# EAGLE design Modular_RFPA_v103_DFM_03_26_22 (EAGLE 6.6.0)

## Sheet 1 of 4
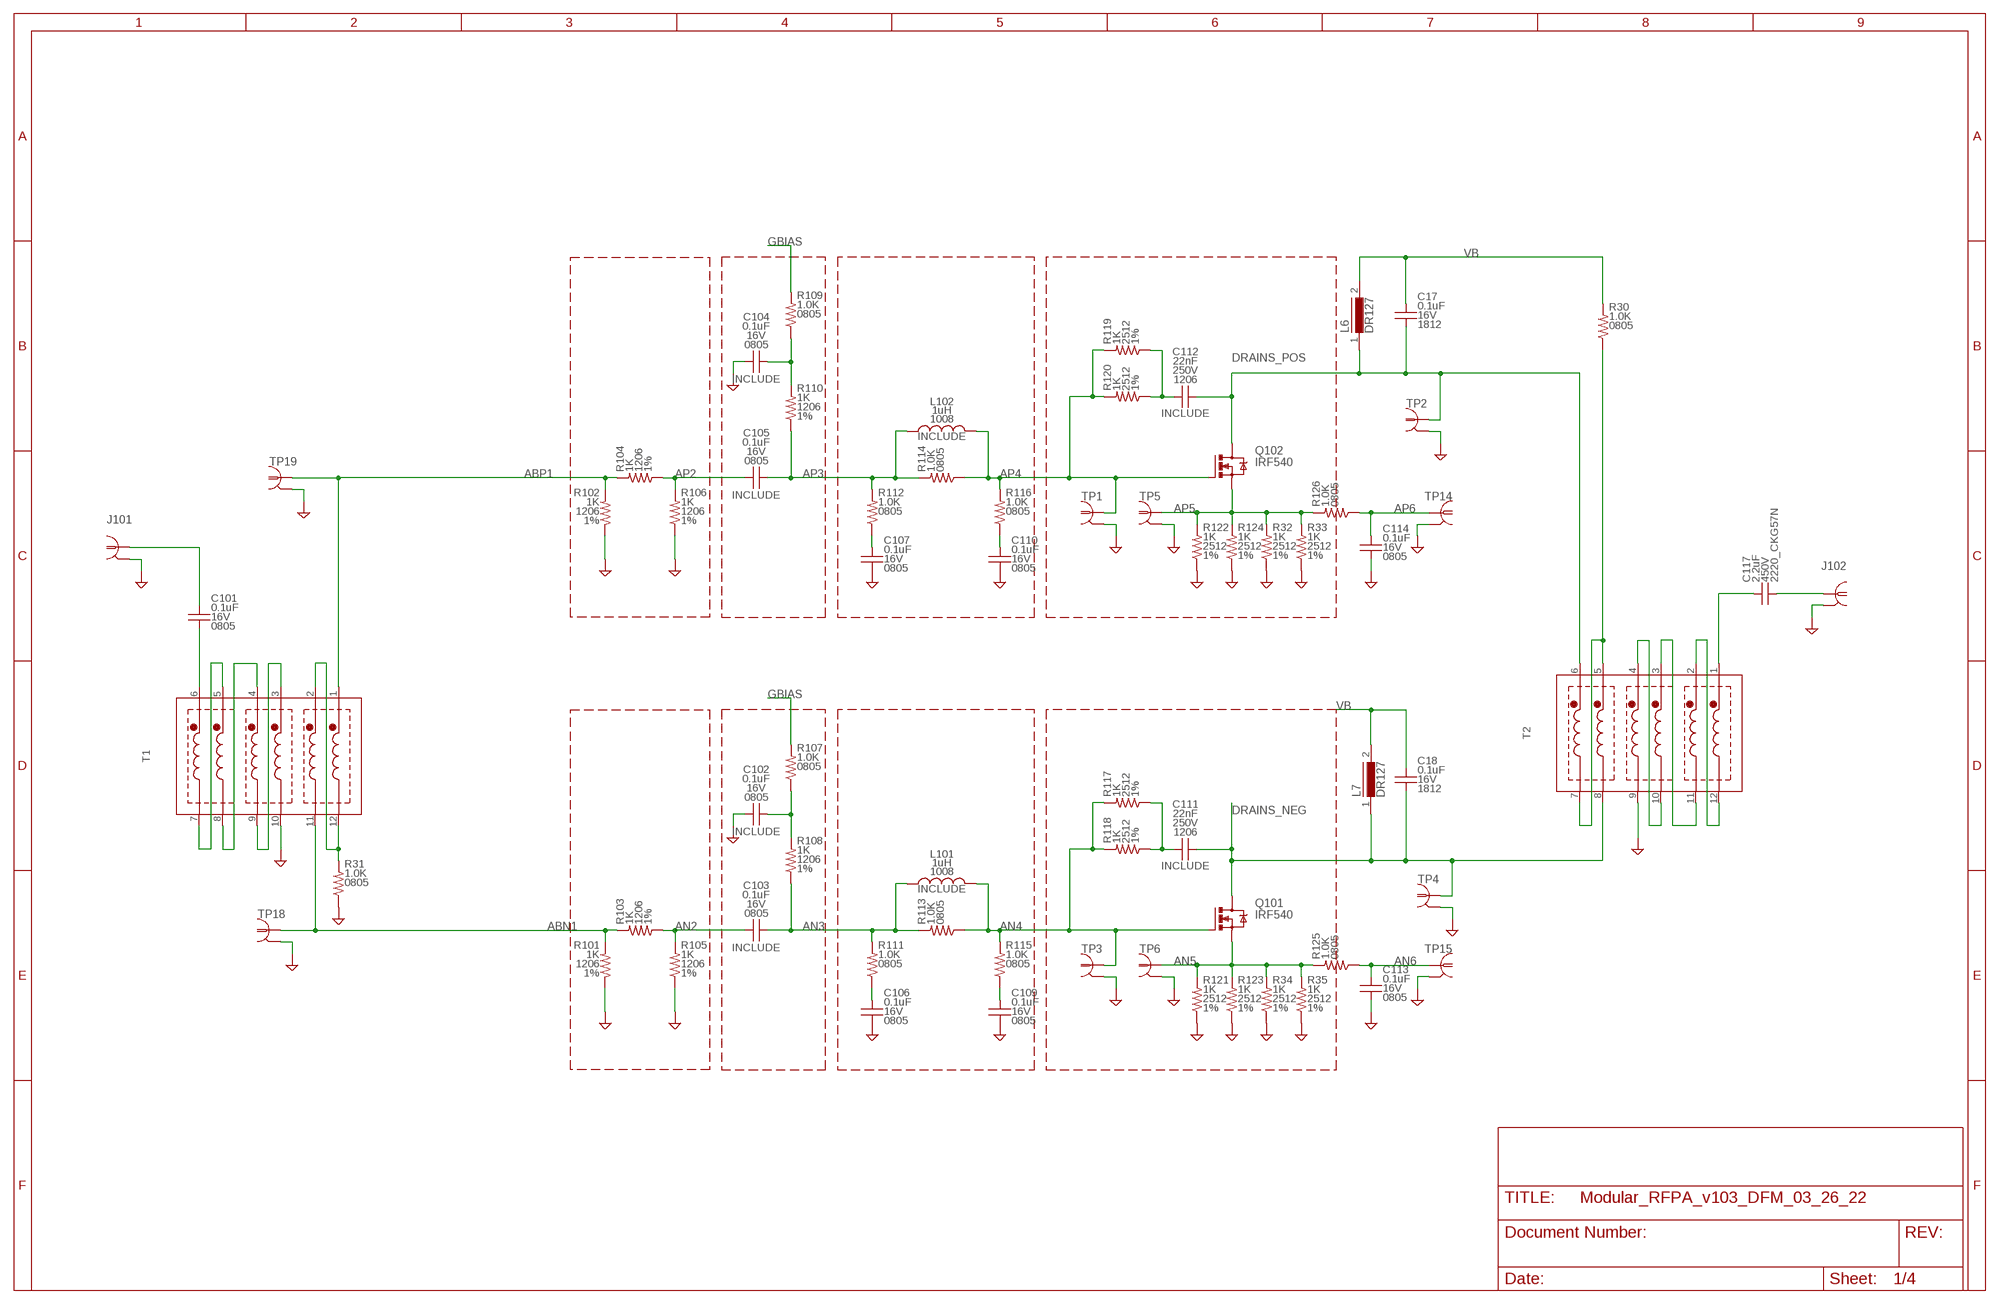
[diagram p0: schematic, sheet 1]

### Parts
C17  0.1uF  CC1812  [C1812]
C18  0.1uF  CC1812  [C1812]
C101  0.1uF  CC-0.1U-16V-0805-X7R0805_IPC  [0805_IPC-7351B]
C102  0.1uF  CC-0.1U-16V-0805-X7R0805_IPC  [0805_IPC-7351B]
C103  0.1uF  CC-0.1U-16V-0805-X7R0805_IPC  [0805_IPC-7351B]
C104  0.1uF  CC-0.1U-16V-0805-X7R0805_IPC  [0805_IPC-7351B]
C105  0.1uF  CC-0.1U-16V-0805-X7R0805_IPC  [0805_IPC-7351B]
C106  0.1uF  CC-0.1U-16V-0805-X7R0805_IPC  [0805_IPC-7351B]
C107  0.1uF  CC-0.1U-16V-0805-X7R0805_IPC  [0805_IPC-7351B]
C109  0.1uF  CC-0.1U-16V-0805-X7R0805_IPC  [0805_IPC-7351B]
C110  0.1uF  CC-0.1U-16V-0805-X7R0805_IPC  [0805_IPC-7351B]
C111  22nF  CC-22N-250V-5%-1206-NP0C1206  [C1206]
C112  22nF  CC-22N-250V-5%-1206-NP0C1206  [C1206]
C113  0.1uF  CC-0.1U-16V-0805-X7R0805_IPC  [0805_IPC-7351B]
C114  0.1uF  CC-0.1U-16V-0805-X7R0805_IPC  [0805_IPC-7351B]
C117  2.2uF  CC-2.2U-450V-20%-2220-X7TC2220_CKG57N  [C2220_CKG57N]
J101  COAXBNC_EDGE  [BNC_EDGE]
J102  COAXBNC_EDGE  [BNC_EDGE]
L6  DR127  [DR127]
L7  DR127  [DR127]
L101  1uH  L_CHIPL-1.0U-AIR-5%-1008-0.37A1008  [L1008]
L102  1uH  L_CHIPL-1.0U-AIR-5%-1008-0.37A1008  [L1008]
Q101  IRF540  [TO220BV]
Q102  IRF540  [TO220BV]
R30  1.0K  RR-1.0K-0.1%-0805-0.1W0805_IPC  [0805_IPC-7351B]
R31  1.0K  RR-1.0K-0.1%-0805-0.1W0805_IPC  [0805_IPC-7351B]
R32  1K  RR-1K-1%-2512-1WR2512  [R2512]
R33  1K  RR-1K-1%-2512-1WR2512  [R2512]
R34  1K  RR-1K-1%-2512-1WR2512  [R2512]
R35  1K  RR-1K-1%-2512-1WR2512  [R2512]
R101  1K  RR-1.0K-1%-1206-0.25WR1206  [R1206]
R102  1K  RR-1.0K-1%-1206-0.25WR1206  [R1206]
R103  1K  RR-1.0K-1%-1206-0.25WR1206  [R1206]
R104  1K  RR-1.0K-1%-1206-0.25WR1206  [R1206]
R105  1K  RR-1.0K-1%-1206-0.25WR1206  [R1206]
R106  1K  RR-1.0K-1%-1206-0.25WR1206  [R1206]
R107  1.0K  RR-1.0K-0.1%-0805-0.1W0805_IPC  [0805_IPC-7351B]
R108  1K  RR-1.0K-1%-1206-0.25WR1206  [R1206]
R109  1.0K  RR-1.0K-0.1%-0805-0.1W0805_IPC  [0805_IPC-7351B]
R110  1K  RR-1.0K-1%-1206-0.25WR1206  [R1206]
R111  1.0K  RR-1.0K-0.1%-0805-0.1W0805_IPC  [0805_IPC-7351B]
R112  1.0K  RR-1.0K-0.1%-0805-0.1W0805_IPC  [0805_IPC-7351B]
R113  1.0K  RR-1.0K-0.1%-0805-0.1W0805_IPC  [0805_IPC-7351B]
R114  1.0K  RR-1.0K-0.1%-0805-0.1W0805_IPC  [0805_IPC-7351B]
R115  1.0K  RR-1.0K-0.1%-0805-0.1W0805_IPC  [0805_IPC-7351B]
R116  1.0K  RR-1.0K-0.1%-0805-0.1W0805_IPC  [0805_IPC-7351B]
R117  1K  RR-1K-1%-2512-1WR2512  [R2512]
R118  1K  RR-1K-1%-2512-1WR2512  [R2512]
R119  1K  RR-1K-1%-2512-1WR2512  [R2512]
R120  1K  RR-1K-1%-2512-1WR2512  [R2512]
R121  1K  RR-1K-1%-2512-1WR2512  [R2512]
R122  1K  RR-1K-1%-2512-1WR2512  [R2512]
R123  1K  RR-1K-1%-2512-1WR2512  [R2512]
R124  1K  RR-1K-1%-2512-1WR2512  [R2512]
R125  1.0K  RR-1.0K-0.1%-0805-0.1W0805_IPC  [0805_IPC-7351B]
R126  1.0K  RR-1.0K-0.1%-0805-0.1W0805_IPC  [0805_IPC-7351B]
T1  HP4_TRAFO  [HP4]
T2  HP4_TRAFO  [HP4]
TP1  PROBE_TPTP_5MM  [PROBE_TP_5MM]
TP2  PROBE_TPTP_7P5MM  [PROBE_TP_7P5MM]
TP3  PROBE_TPTP_5MM  [PROBE_TP_5MM]
TP4  PROBE_TPTP_7P5MM  [PROBE_TP_7P5MM]
TP5  PROBE_TPTP_7P5MM  [PROBE_TP_7P5MM]
TP6  PROBE_TPTP_7P5MM  [PROBE_TP_7P5MM]
TP14  PROBE_TPTP_5MM  [PROBE_TP_5MM]
TP15  PROBE_TPTP_5MM  [PROBE_TP_5MM]
TP18  PROBE_TPTP_5MM  [PROBE_TP_5MM]
TP19  PROBE_TPTP_5MM  [PROBE_TP_5MM]

### Nets
ABN1: R101.1 R103.1 T1.11(F2) TP18.TP ; also sheet 2
ABP1: R102.1 R104.1 T1.1(S1) TP19.TP ; also sheet 2
AN2: C103.2 R103.2 R105.1
AN3: C103.1 L101.1 R108.2 R111.1 R113.1
AN4: L101.2 Q101.G R113.2 R115.1 R117.1 R118.1 TP3.TP
AN5: Q101.S R34.1 R35.1 R121.1 R123.1 R125.1 TP6.TP
AN6: C113.1 R125.2 TP15.TP
AP2: C105.2 R104.2 R106.1
AP3: C105.1 L102.1 R110.2 R112.1 R114.1
AP4: L102.2 Q102.G R114.2 R116.1 R119.1 R120.1 TP1.TP
AP5: Q102.S R32.1 R33.1 R122.1 R124.1 R126.1 TP5.TP
AP6: C114.1 R126.2 TP14.TP
DRAINS_NEG [32W_20S]: C18.2 C111.2 L7.1 Q101.D T2.8(F5) TP4.TP ; also sheet 2
DRAINS_POS [32W_30S]: C17.2 C112.2 L6.1 Q102.D T2.6(S6) TP2.TP ; also sheet 2
GBIAS: R107.1 R109.1 ; also sheet 2,3
GND: C102.2 C104.2 C106.2 C107.2 C109.2 C110.2 C113.2 C114.2 J101.G1(GND1) J101.G2(GND1) J101.G3(GND1) J101.G4(GND1) J102.G1(GND1) J102.G2(GND1) J102.G3(GND1) J102.G4(GND1) R31.2 R32.2 R33.2 R34.2 R35.2 R101.2 R102.2 R105.2 R106.2 R121.2 R122.2 R123.2 R124.2 T1.10(F3) T2.9(F4) TP1.GND(GND1) TP2.GND(GND1) TP3.GND(GND1) TP4.GND(GND1) TP5.GND(GND1) TP6.GND(GND1) TP14.GND(GND1) TP15.GND(GND1) TP18.GND(GND1) TP19.GND(GND1) ; also sheet 2,3,4
N$4: C111.1 R117.2 R118.2
N$5: C106.1 R111.2
N$8: C104.1 R109.2 R110.1
N$10: C107.1 R112.2
N$11: C110.1 R116.2
N$12: C112.1 R119.2 R120.2
N$13: C102.1 R107.2 R108.1
N$17: C109.1 R115.2
N$22: T1.3(S3) T1.9(F4)
N$27: R31.1 T1.2(S2) T1.12(F1)
N$29 [32W_30S]: T2.2(S2) T2.12(F1)
N$30 [32W_30S]: C117.1 T2.1(S1)
N$31 [32W_30S]: C117.2 J102.C
N$34: C101.1 J101.C
N$41: C101.2 T1.6(S6)
N$52 [32W_30S]: T2.3(S3) T2.11(F2)
N$57: T1.4(S4) T1.8(F5)
N$58 [32W_30S]: T2.4(S4) T2.10(F3)
VB [50W_30S]: C17.1 C18.1 L6.2 L7.2 R30.1 ; also sheet 4
VB_CT [32W_30S]: R30.2 T2.5(S5) T2.7(F6)
VB_CT1: T1.5(S5) T1.7(F6)

## Sheet 2 of 4
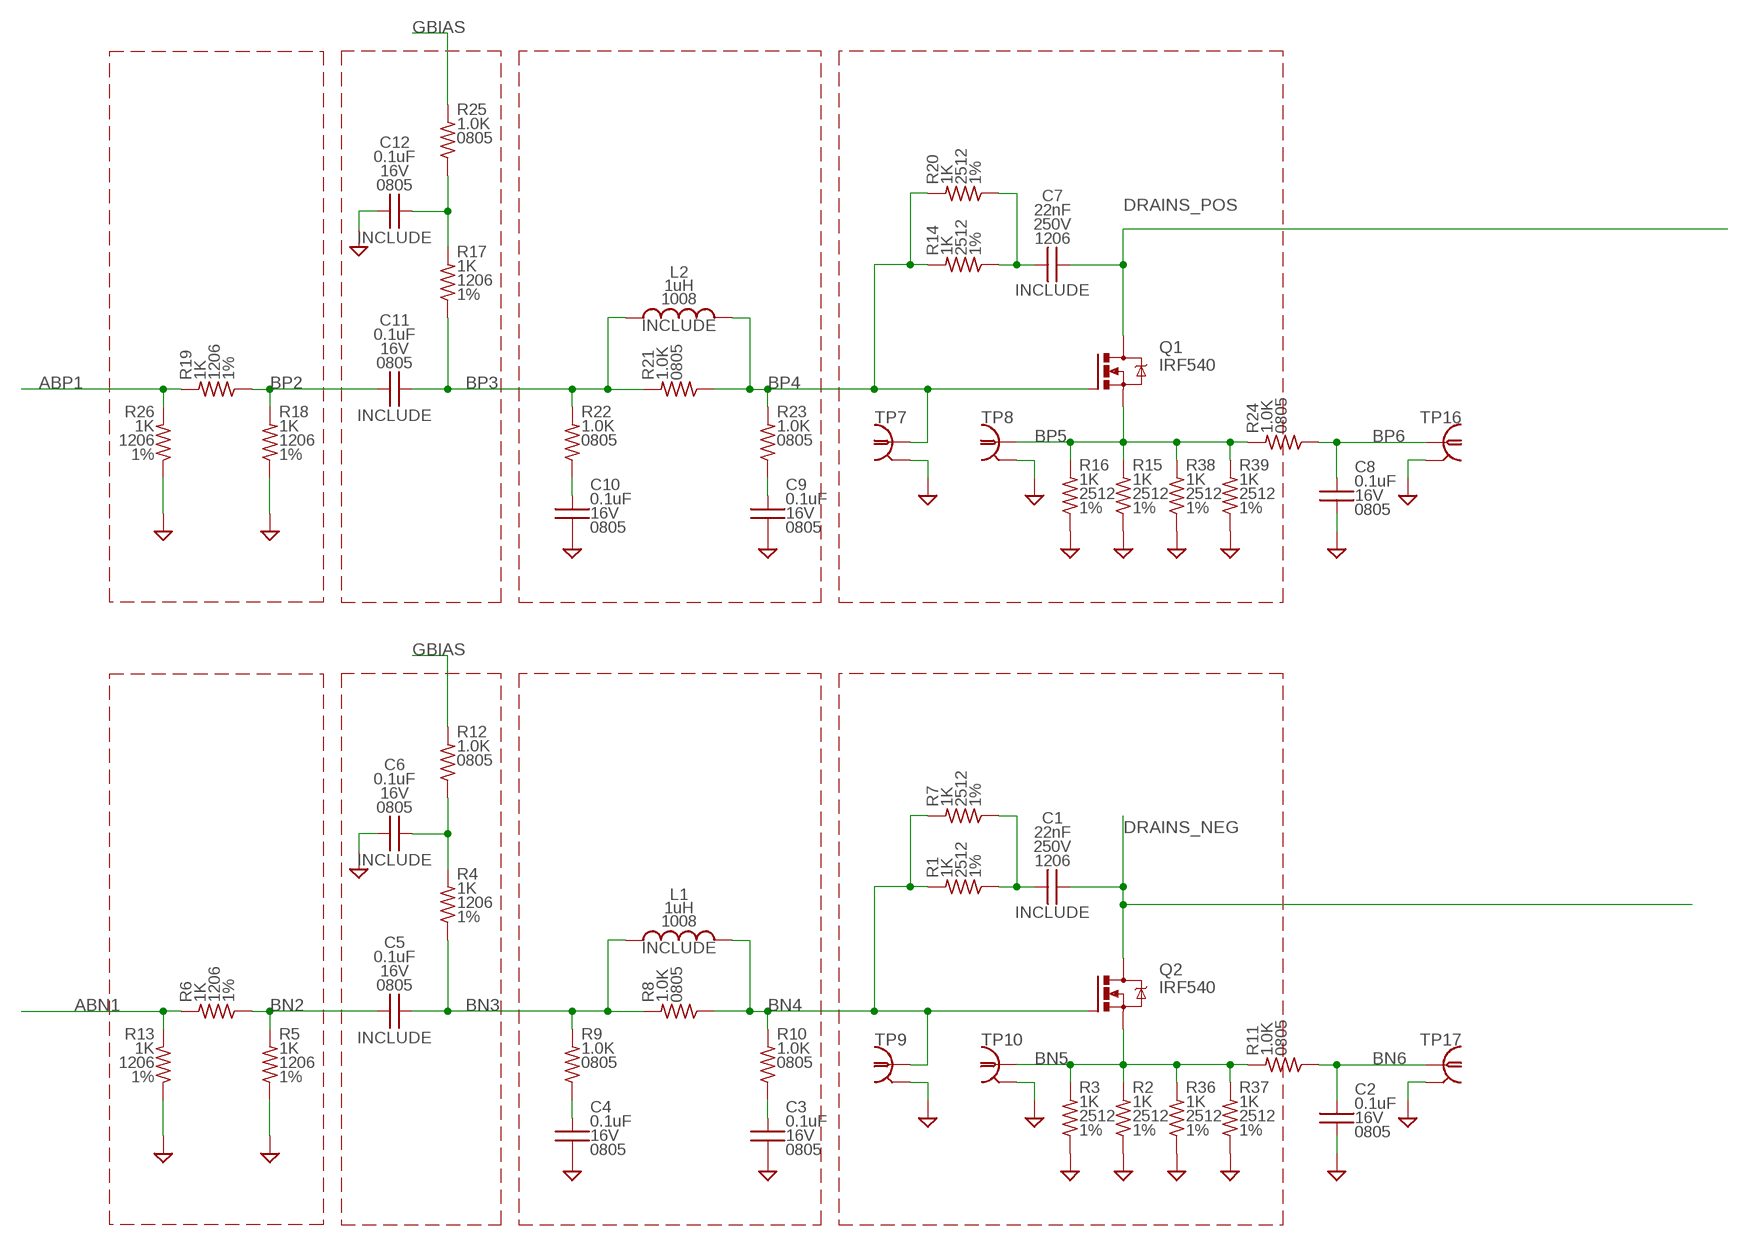
[diagram p1: schematic, sheet 2]

### Parts
C1  22nF  CC-22N-250V-5%-1206-NP0C1206  [C1206]
C2  0.1uF  CC-0.1U-16V-0805-X7R0805_IPC  [0805_IPC-7351B]
C3  0.1uF  CC-0.1U-16V-0805-X7R0805_IPC  [0805_IPC-7351B]
C4  0.1uF  CC-0.1U-16V-0805-X7R0805_IPC  [0805_IPC-7351B]
C5  0.1uF  CC-0.1U-16V-0805-X7R0805_IPC  [0805_IPC-7351B]
C6  0.1uF  CC-0.1U-16V-0805-X7R0805_IPC  [0805_IPC-7351B]
C7  22nF  CC-22N-250V-5%-1206-NP0C1206  [C1206]
C8  0.1uF  CC-0.1U-16V-0805-X7R0805_IPC  [0805_IPC-7351B]
C9  0.1uF  CC-0.1U-16V-0805-X7R0805_IPC  [0805_IPC-7351B]
C10  0.1uF  CC-0.1U-16V-0805-X7R0805_IPC  [0805_IPC-7351B]
C11  0.1uF  CC-0.1U-16V-0805-X7R0805_IPC  [0805_IPC-7351B]
C12  0.1uF  CC-0.1U-16V-0805-X7R0805_IPC  [0805_IPC-7351B]
L1  1uH  L_CHIPL-1.0U-AIR-5%-1008-0.37A1008  [L1008]
L2  1uH  L_CHIPL-1.0U-AIR-5%-1008-0.37A1008  [L1008]
Q1  IRF540  [TO220BV]
Q2  IRF540  [TO220BV]
R1  1K  RR-1K-1%-2512-1WR2512  [R2512]
R2  1K  RR-1K-1%-2512-1WR2512  [R2512]
R3  1K  RR-1K-1%-2512-1WR2512  [R2512]
R4  1K  RR-1.0K-1%-1206-0.25WR1206  [R1206]
R5  1K  RR-1.0K-1%-1206-0.25WR1206  [R1206]
R6  1K  RR-1.0K-1%-1206-0.25WR1206  [R1206]
R7  1K  RR-1K-1%-2512-1WR2512  [R2512]
R8  1.0K  RR-1.0K-0.1%-0805-0.1W0805_IPC  [0805_IPC-7351B]
R9  1.0K  RR-1.0K-0.1%-0805-0.1W0805_IPC  [0805_IPC-7351B]
R10  1.0K  RR-1.0K-0.1%-0805-0.1W0805_IPC  [0805_IPC-7351B]
R11  1.0K  RR-1.0K-0.1%-0805-0.1W0805_IPC  [0805_IPC-7351B]
R12  1.0K  RR-1.0K-0.1%-0805-0.1W0805_IPC  [0805_IPC-7351B]
R13  1K  RR-1.0K-1%-1206-0.25WR1206  [R1206]
R14  1K  RR-1K-1%-2512-1WR2512  [R2512]
R15  1K  RR-1K-1%-2512-1WR2512  [R2512]
R16  1K  RR-1K-1%-2512-1WR2512  [R2512]
R17  1K  RR-1.0K-1%-1206-0.25WR1206  [R1206]
R18  1K  RR-1.0K-1%-1206-0.25WR1206  [R1206]
R19  1K  RR-1.0K-1%-1206-0.25WR1206  [R1206]
R20  1K  RR-1K-1%-2512-1WR2512  [R2512]
R21  1.0K  RR-1.0K-0.1%-0805-0.1W0805_IPC  [0805_IPC-7351B]
R22  1.0K  RR-1.0K-0.1%-0805-0.1W0805_IPC  [0805_IPC-7351B]
R23  1.0K  RR-1.0K-0.1%-0805-0.1W0805_IPC  [0805_IPC-7351B]
R24  1.0K  RR-1.0K-0.1%-0805-0.1W0805_IPC  [0805_IPC-7351B]
R25  1.0K  RR-1.0K-0.1%-0805-0.1W0805_IPC  [0805_IPC-7351B]
R26  1K  RR-1.0K-1%-1206-0.25WR1206  [R1206]
R36  1K  RR-1K-1%-2512-1WR2512  [R2512]
R37  1K  RR-1K-1%-2512-1WR2512  [R2512]
R38  1K  RR-1K-1%-2512-1WR2512  [R2512]
R39  1K  RR-1K-1%-2512-1WR2512  [R2512]
TP7  PROBE_TPTP_5MM  [PROBE_TP_5MM]
TP8  PROBE_TPTP_7P5MM  [PROBE_TP_7P5MM]
TP9  PROBE_TPTP_5MM  [PROBE_TP_5MM]
TP10  PROBE_TPTP_5MM  [PROBE_TP_5MM]
TP16  PROBE_TPTP_5MM  [PROBE_TP_5MM]
TP17  PROBE_TPTP_7P5MM  [PROBE_TP_7P5MM]

### Nets
ABN1: R6.1 R13.1 ; also sheet 1
ABP1: R19.1 R26.1 ; also sheet 1
BN2: C5.2 R5.1 R6.2
BN3: C5.1 L1.1 R4.2 R8.1 R9.1
BN4: L1.2 Q2.G R1.1 R7.1 R8.2 R10.1 TP9.TP
BN5: Q2.S R2.1 R3.1 R11.1 R36.1 R37.1 TP10.TP
BN6: C2.1 R11.2 TP17.TP
BP2: C11.2 R18.1 R19.2
BP3: C11.1 L2.1 R17.2 R21.1 R22.1
BP4: L2.2 Q1.G R14.1 R20.1 R21.2 R23.1 TP7.TP
BP5: Q1.S R15.1 R16.1 R24.1 R38.1 R39.1 TP8.TP
BP6: C8.1 R24.2 TP16.TP
DRAINS_NEG [32W_20S]: C1.2 Q2.D ; also sheet 1
DRAINS_POS [32W_30S]: C7.2 Q1.D ; also sheet 1
GBIAS: R12.1 R25.1 ; also sheet 1,3
GND: C2.2 C3.2 C4.2 C6.2 C8.2 C9.2 C10.2 C12.2 R2.2 R3.2 R5.2 R13.2 R15.2 R16.2 R18.2 R26.2 R36.2 R37.2 R38.2 R39.2 TP7.GND(GND1) TP8.GND(GND1) TP9.GND(GND1) TP10.GND(GND1) TP16.GND(GND1) TP17.GND(GND1) ; also sheet 1,3,4
N$35: C6.1 R4.1 R12.2
N$36: C4.1 R9.2
N$38: C3.1 R10.2
N$39: C1.1 R1.2 R7.2
N$40: C12.1 R17.1 R25.2
N$42: C10.1 R22.2
N$48: C9.1 R23.2
N$50: C7.1 R14.2 R20.2

## Sheet 3 of 4
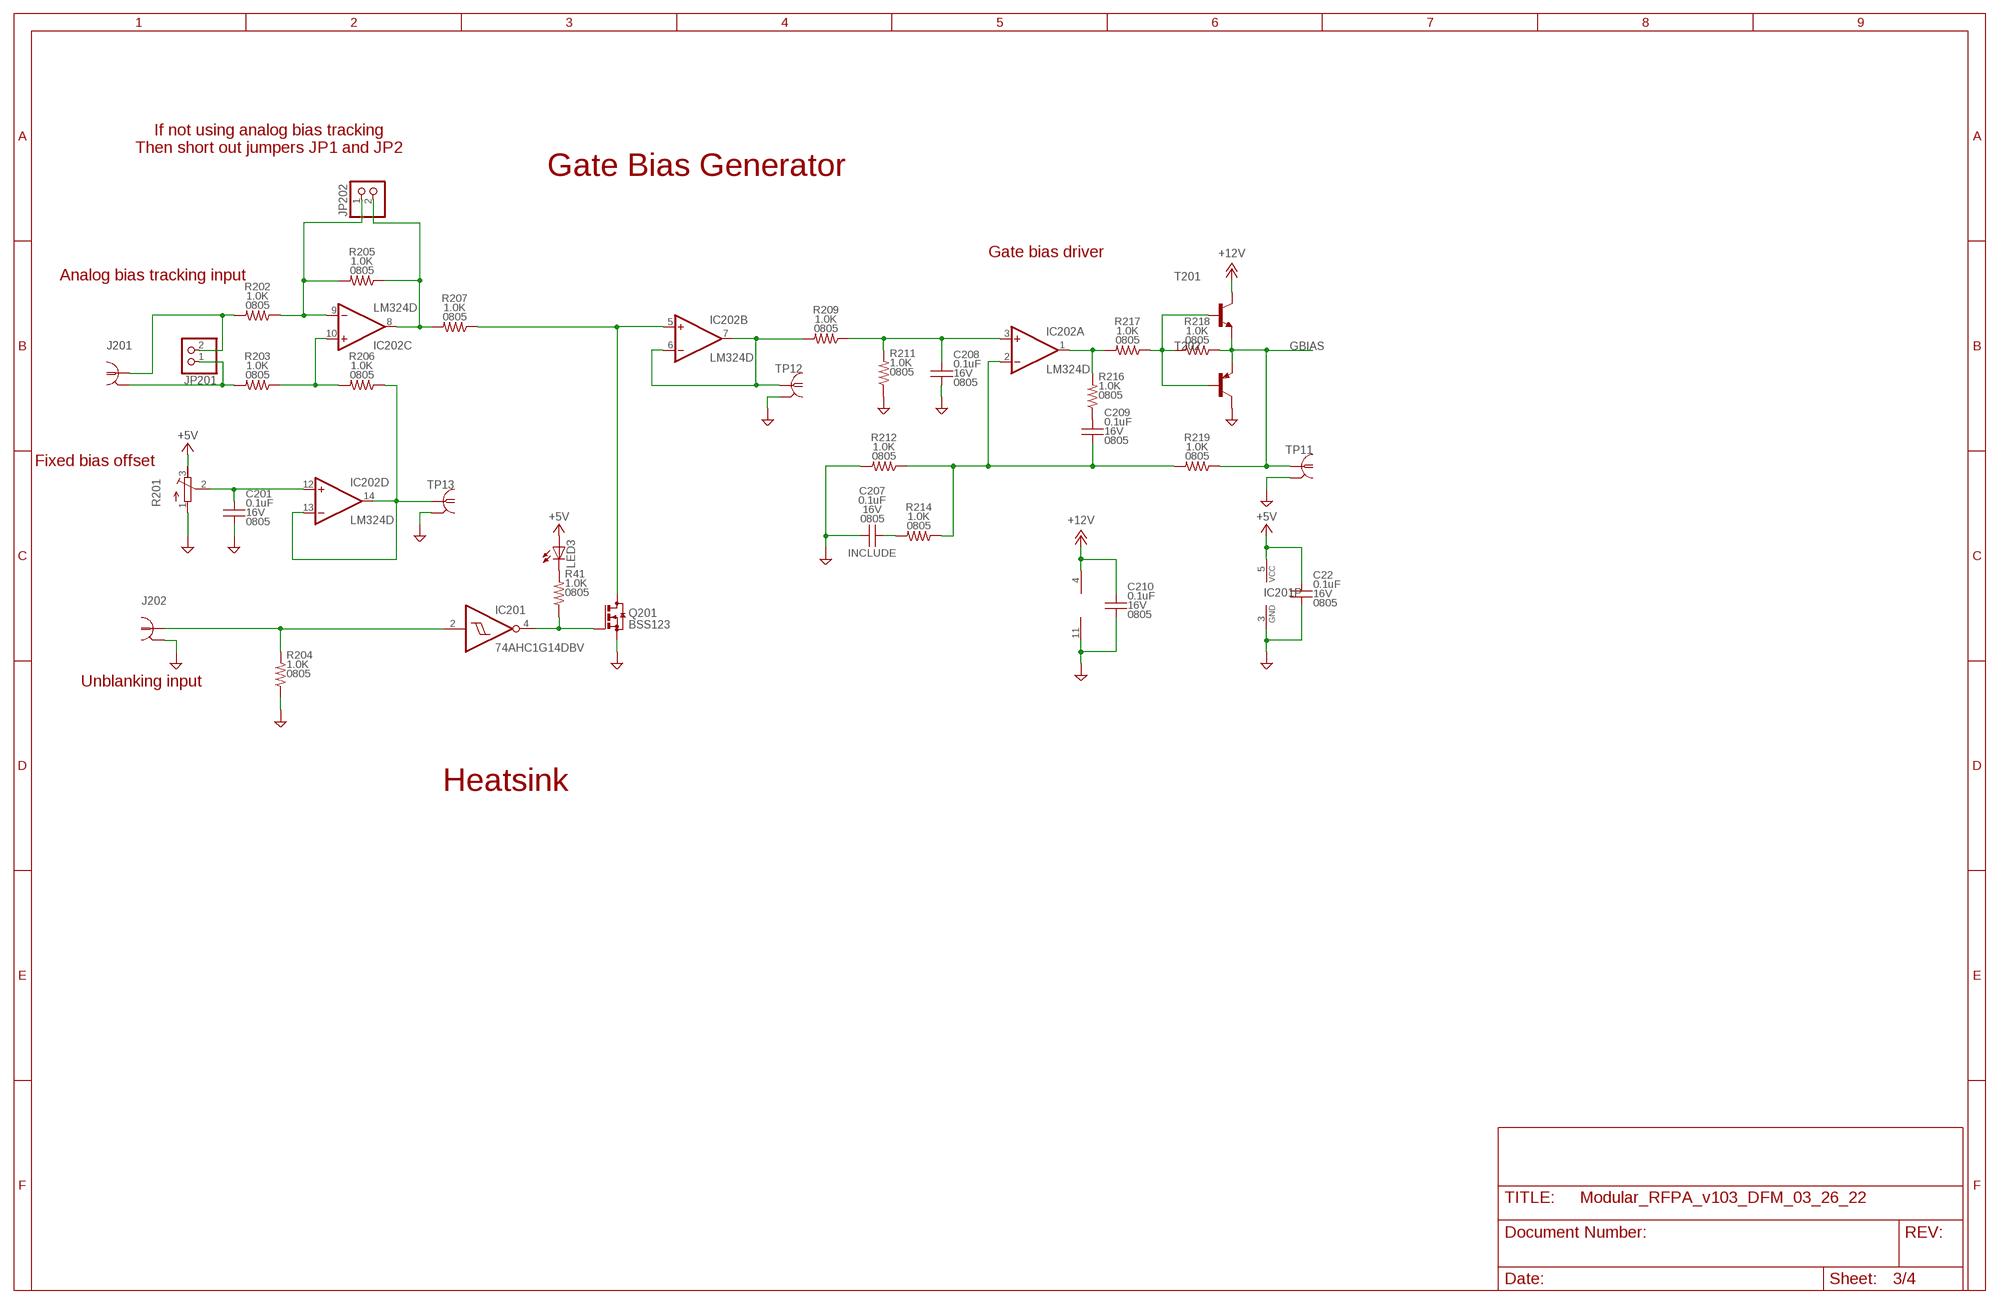
[diagram p2: schematic, sheet 3]

### Parts
C22  0.1uF  CC-0.1U-16V-0805-X7R0805_IPC  [0805_IPC-7351B]
C201  0.1uF  CC-0.1U-16V-0805-X7R0805_IPC  [0805_IPC-7351B]
C207  0.1uF  CC-0.1U-16V-0805-X7R0805_IPC  [0805_IPC-7351B]
C208  0.1uF  CC-0.1U-16V-0805-X7R0805_IPC  [0805_IPC-7351B]
C209  0.1uF  CC-0.1U-16V-0805-X7R0805_IPC  [0805_IPC-7351B]
C210  0.1uF  CC-0.1U-16V-0805-X7R0805_IPC  [0805_IPC-7351B]
IC201  74AHC1G14DBV  [SOT23-5]
IC202  LM324D  [SO14]
J201  COAXBNC_EDGE  [BNC_EDGE]
J202  COAXBNC_EDGE  [BNC_EDGE]
JP201  PINHD-1X2  [1X02]
JP202  PINHD-1X2  [1X02]
LED3  LED5MM  [LED5MM]
Q201  BSS123  [SOT23]
R41  1.0K  RR-1.0K-0.1%-0805-0.1W0805_IPC  [0805_IPC-7351B]
R201  R-TRIMM3299W  [RTRIM3299W]
R202  1.0K  RR-1.0K-0.1%-0805-0.1W0805_IPC  [0805_IPC-7351B]
R203  1.0K  RR-1.0K-0.1%-0805-0.1W0805_IPC  [0805_IPC-7351B]
R204  1.0K  RR-1.0K-0.1%-0805-0.1W0805_IPC  [0805_IPC-7351B]
R205  1.0K  RR-1.0K-0.1%-0805-0.1W0805_IPC  [0805_IPC-7351B]
R206  1.0K  RR-1.0K-0.1%-0805-0.1W0805_IPC  [0805_IPC-7351B]
R207  1.0K  RR-1.0K-0.1%-0805-0.1W0805_IPC  [0805_IPC-7351B]
R209  1.0K  RR-1.0K-0.1%-0805-0.1W0805_IPC  [0805_IPC-7351B]
R211  1.0K  RR-1.0K-0.1%-0805-0.1W0805_IPC  [0805_IPC-7351B]
R212  1.0K  RR-1.0K-0.1%-0805-0.1W0805_IPC  [0805_IPC-7351B]
R214  1.0K  RR-1.0K-0.1%-0805-0.1W0805_IPC  [0805_IPC-7351B]
R216  1.0K  RR-1.0K-0.1%-0805-0.1W0805_IPC  [0805_IPC-7351B]
R217  1.0K  RR-1.0K-0.1%-0805-0.1W0805_IPC  [0805_IPC-7351B]
R218  1.0K  RR-1.0K-0.1%-0805-0.1W0805_IPC  [0805_IPC-7351B]
R219  1.0K  RR-1.0K-0.1%-0805-0.1W0805_IPC  [0805_IPC-7351B]
T201  BC808-NPN-SOT23-BEC  [SOT23-BEC]
T202  BC807-16-PNP-SOT23-BEC  [SOT23-BEC]
TP11  PROBE_TPTP_5MM  [PROBE_TP_5MM]
TP12  PROBE_TPTP_5MM  [PROBE_TP_5MM]
TP13  PROBE_TPTP_5MM  [PROBE_TP_5MM]

### Nets
+5V: C22.1 IC201.5(VCC) LED3.A R201.3(E) ; also sheet 4
+12V: C210.1 IC202.4(P:V+) T201.C ; also sheet 4
GBIAS: R218.2 R219.2 T201.E T202.E TP11.TP ; also sheet 1,2
GND: C22.2 C201.2 C207.2 C208.2 C210.2 IC201.3(GND) IC202.11(P:V-) J202.G1(GND1) J202.G2(GND1) J202.G3(GND1) J202.G4(GND1) Q201.2(S) R201.1(A) R204.2 R211.2 R212.1 T202.C TP11.GND(GND1) TP12.GND(GND1) TP13.GND(GND1) ; also sheet 1,2,4
N$1: IC202.1(A:OUT) R216.1 R217.1
N$2: R217.2 R218.1 T201.B T202.B
N$3: IC201.2(I) J202.C R204.1
N$6: IC202.6(B:-IN) IC202.7(B:OUT) R209.1 TP12.TP
N$7: C209.1 R216.2
N$9: C207.1 R214.1
N$14: C209.2 IC202.2(A:-IN) R212.2 R214.2 R219.1
N$15: C208.1 IC202.3(A:+IN) R209.2 R211.1
N$16: IC202.10(C:+IN) R203.2 R206.1
N$18: IC202.8(C:OUT) JP202.2 R205.2 R207.1
N$19: IC202.9(C:-IN) JP202.1 R202.2 R205.1
N$20: J201.C JP201.2 R202.1
N$21: J201.G1(GND1) J201.G2(GND1) J201.G3(GND1) J201.G4(GND1) JP201.1 R203.1
N$23: IC202.5(B:+IN) Q201.3(D) R207.2
N$24: IC201.4(O) Q201.1(G) R41.2
N$25: C201.1 IC202.12(D:+IN) R201.2(S)
N$26: IC202.13(D:-IN) IC202.14(D:OUT) R206.2 TP13.TP
N$37: LED3.K(C) R41.1

### Notes on the sheet
- If not using analog bias tracking
  Then short out jumpers JP1 and JP2
- Gate Bias Generator
- Gate bias driver
- Analog bias tracking input
- Fixed bias offset
- Unblanking input
- Heatsink

## Sheet 4 of 4: Power entry
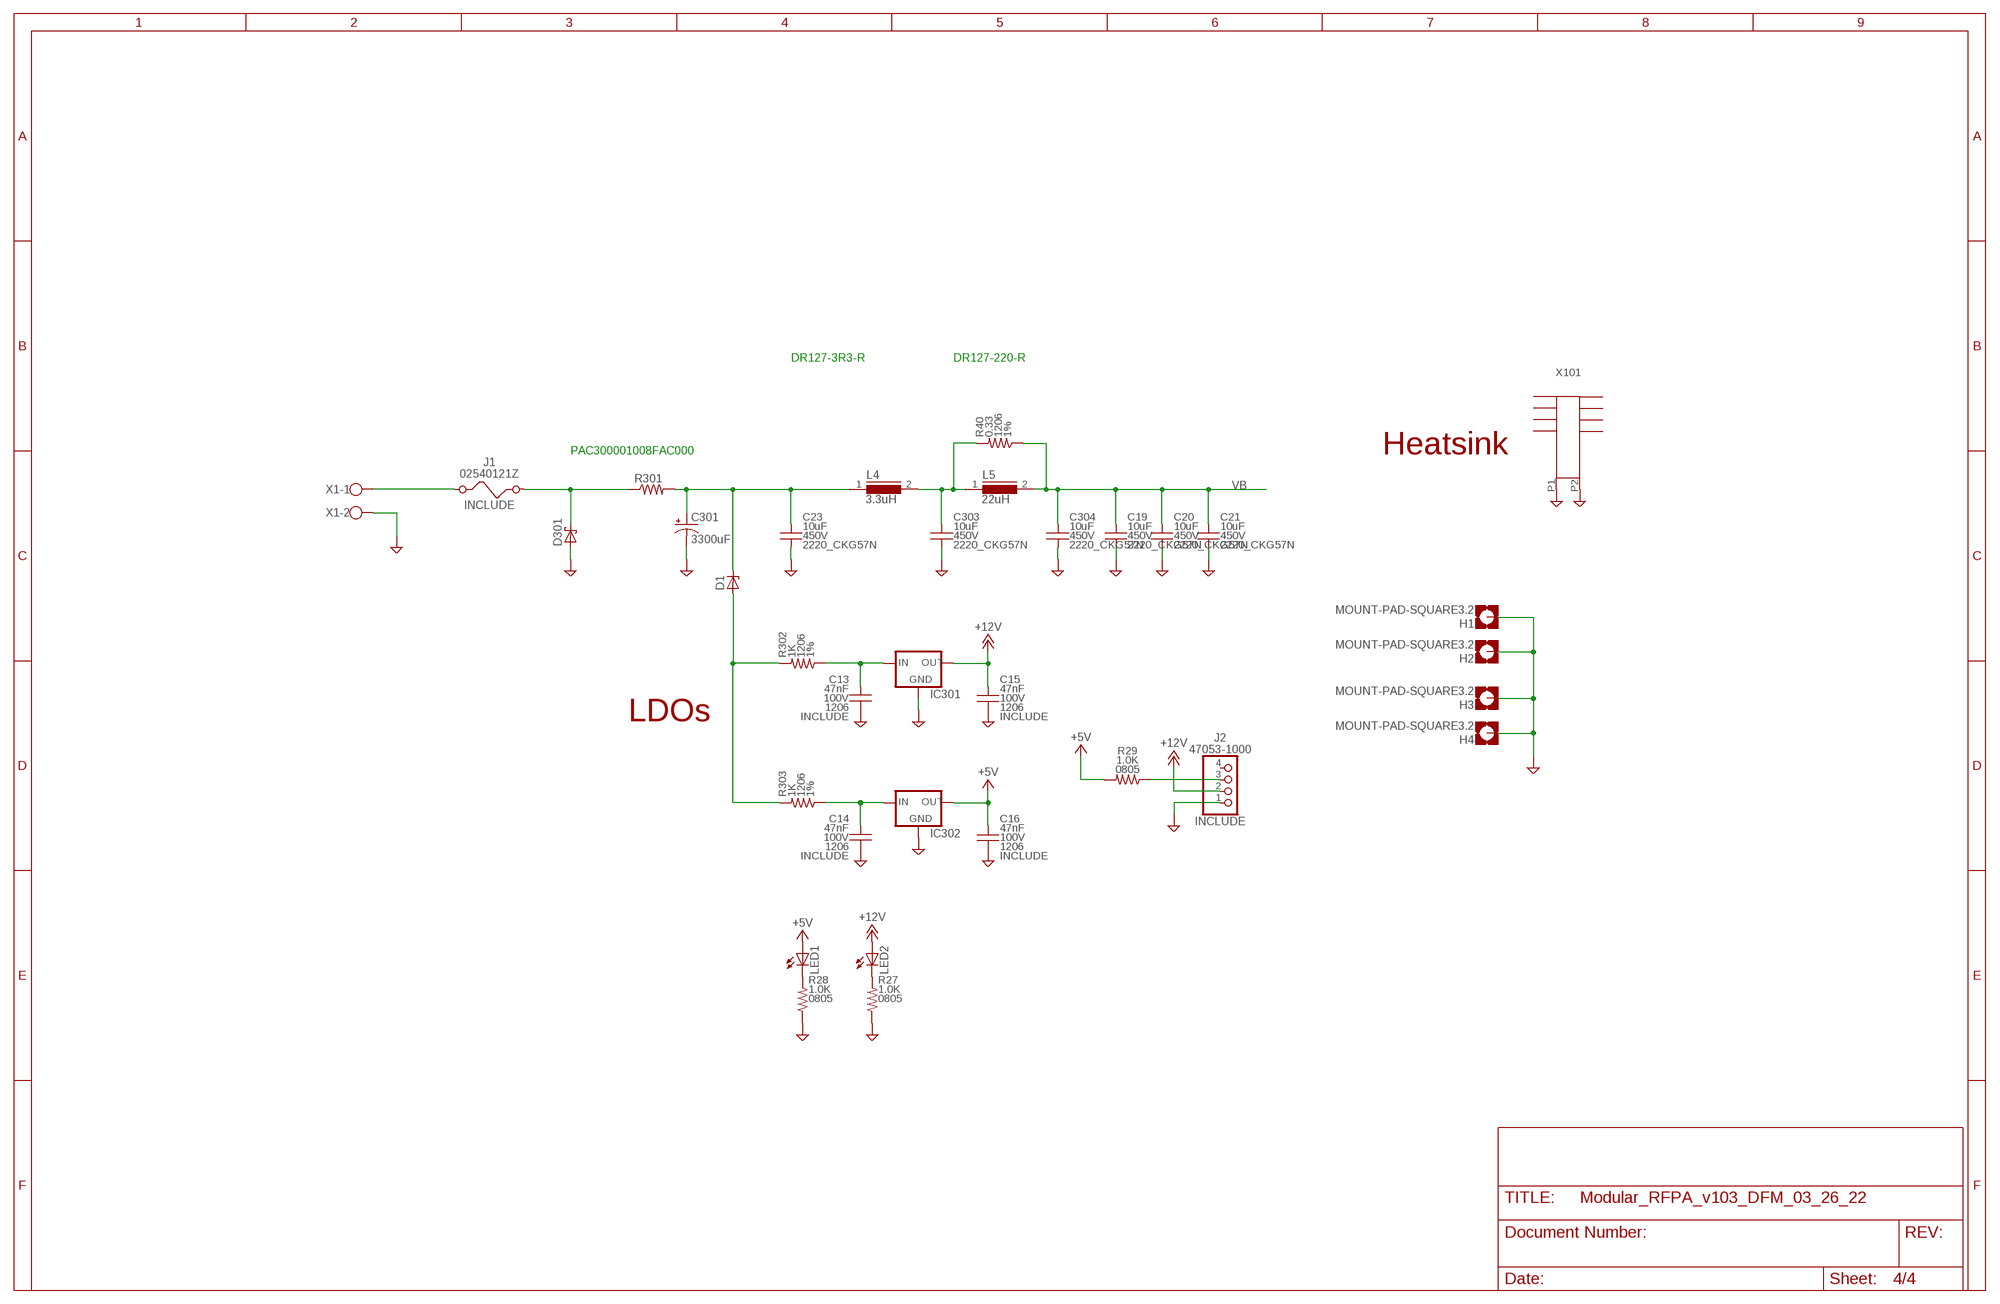
[diagram p3: schematic, sheet 4]

### Parts
C13  47nF  CC-47N-100V-5%-1206-NP0C1206  [C1206]
C14  47nF  CC-47N-100V-5%-1206-NP0C1206  [C1206]
C15  47nF  CC-47N-100V-5%-1206-NP0C1206  [C1206]
C16  47nF  CC-47N-100V-5%-1206-NP0C1206  [C1206]
C19  10uF  CC-2.2U-450V-20%-2220-X7TC2220_CKG57N  [C2220_CKG57N]
C20  10uF  CC-2.2U-450V-20%-2220-X7TC2220_CKG57N  [C2220_CKG57N]
C21  10uF  CC-2.2U-450V-20%-2220-X7TC2220_CKG57N  [C2220_CKG57N]
C23  10uF  CC-2.2U-450V-20%-2220-X7TC2220_CKG57N  [C2220_CKG57N]
C301  3300uF  CPOL-USE10-25  [EB25D]
C303  10uF  CC-2.2U-450V-20%-2220-X7TC2220_CKG57N  [C2220_CKG57N]
C304  10uF  CC-2.2U-450V-20%-2220-X7TC2220_CKG57N  [C2220_CKG57N]
D1  ZENER-DIODEDO41Z10  [DO41Z10]
D301  SCHOTTKY-DIODESMC  [SMC]
H1  MOUNT-PAD-SQUARE3.2  [3,2-PAD-SQUARE]
H2  MOUNT-PAD-SQUARE3.2  [3,2-PAD-SQUARE]
H3  MOUNT-PAD-SQUARE3.2  [3,2-PAD-SQUARE]
H4  MOUNT-PAD-SQUARE3.2  [3,2-PAD-SQUARE]
IC301  78XXS  [78XXS]
IC302  78XXS  [78XXS]
J1  FUSE_2P  [02540121Z]
J2  KK_PCFAN  [47053-1000]
L4  3.3uH  DR127  [DR127]
L5  22uH  DR127  [DR127]
LED1  LED5MM  [LED5MM]
LED2  LED5MM  [LED5MM]
R27  1.0K  RR-1.0K-0.1%-0805-0.1W0805_IPC  [0805_IPC-7351B]
R28  1.0K  RR-1.0K-0.1%-0805-0.1W0805_IPC  [0805_IPC-7351B]
R29  1.0K  RR-1.0K-0.1%-0805-0.1W0805_IPC  [0805_IPC-7351B]
R40  0.33  RR-1.0K-1%-1206-0.25WR1206  [R1206]
R301  R-US_0817/7V  [P0817V]
R302  1K  RR-1.0K-1%-1206-0.25WR1206  [R1206]
R303  1K  RR-1.0K-1%-1206-0.25WR1206  [R1206]
X1  W237-102  [W237-102]
X101  HEATSINK_OMNI_DUAL30-75-D  [OMNI-UNI-30-75-D]

### Nets
+5V: C16.1 IC302.OUT LED1.A R29.1 ; also sheet 3
+12V: C15.1 IC301.OUT J2.2 LED2.A ; also sheet 3
GND: C13.2 C14.2 C15.2 C16.2 C19.2 C20.2 C21.2 C23.2 C301.- C303.2 C304.2 D301.A H1.B3,2(MOUNT) H2.B3,2(MOUNT) H3.B3,2(MOUNT) H4.B3,2(MOUNT) IC301.GND IC302.GND J2.1 R27.2 R28.2 X1.2 X101.P1 X101.P2 ; also sheet 1,2,3
N$28: D1.A R302.1 R303.1
N$32: LED2.K(C) R27.1
N$33: LED1.K(C) R28.1
N$43: C13.1 IC301.IN R302.2
N$44: D301.C J1.2 R301.1
N$45: J1.1 X1.1
N$46: C23.1 C301.+ D1.C L4.1 R301.2
N$47: C303.1 L4.2 L5.1 R40.1
N$49: C14.1 IC302.IN R303.2
N$51: J2.3 R29.2
VB [50W_30S]: C19.1 C20.1 C21.1 C304.1 L5.2 R40.2 ; also sheet 1
Unconnected: J2.4

### Notes on the sheet
- DR127-3R3-R | DR127-220-R
- PAC300001008FAC000 | Heatsink
- LDOs

## Library data of the parts
C1 C7 C111 C112 = MDT_C:C; BOM: INCLUDE; DIALECTRIC: NP0; PACKAGE: 1206; PARTNO: C3216NP02E223J160AA; TOL: 5; VOLTAGE: 250V
C2-C4 C8-C10 C22 C101 C106 C107 C109 C110 C113 C114 C201 C208-C210 = MDT_C:C; PACKAGE: 0805; VOLTAGE: 16V
C5 C6 C11 C12 C102-C105 C207 = MDT_C:C; BOM: INCLUDE; PACKAGE: 0805; VOLTAGE: 16V
C13-C16 = MDT_C:C; BOM: INCLUDE; DIALECTRIC: NP0; PACKAGE: 1206; PARTNO: C3216C0G2A473J115AC; TOL: 5; VOLTAGE: 100V
C17 C18 = MDT_C:C; PACKAGE: 1812; VOLTAGE: 16V
C19-C21 C23 C303 C304 = MDT_C:C; DIALECTRIC: X7T; PACKAGE: 2220_CKG57N; PARTNO: CKG57NX7T2W225M500JJ; TOL: 20%; VALUE: 2.2uF; VOLTAGE: 450V
C117 = MDT_C:C; DIALECTRIC: X7T; PACKAGE: 2220_CKG57N; PARTNO: CKG57NX7T2W225M500JJ; TOL: 20%; VOLTAGE: 450V
C301 = rcl:CPOL-US: POLARIZED CAPACITOR, American symbol
D1 = diode:ZENER-DIODE: Z-Diode
D301 = diode:SCHOTTKY-DIODE: Schottky Diode
H1-H4 = holes:MOUNT-PAD-SQUARE: MOUNTING PAD, square
IC201 = 74xx-little-us:74*1G14: Single Schmitt-Trigger Inverter Gate
IC202 = linear:LM324: OP AMP
IC301 IC302 = v-reg:78XXS: VOLTAGE REGULATOR
J1 = MDT_FUSE:FUSE_2P; BOM: INCLUDE; PARTNO: 02540121Z
J2 = MDT_CON:KK_PCFAN; BOM: INCLUDE; PARTNO: 47053-1000
J101 J102 J201 J202 = MDT_CON:COAX
JP201 JP202 = pinhead:PINHD-1X2: PIN HEADER
L1 L2 L101 L102 = MDT_L:L_CHIP; BOM: INCLUDE; CORE: AIR; DCR: 1.8; IDC: 0.37A; PACKAGE: 1008; PARTNO: 1008CS-102XJEC; TOL: 5%
L4-L7 = inductors:DR127: High Power Density, High Efficiency, Shielded Inductors Source: coiltronics_dr_series.pdf
LED1-LED3 = led:LED: LED OSRAM: - CHIPLED LG R971, LG N971, LY N971, LG Q971, LY Q971, LO R971, LY R971 LH N974, LH R974 LS Q976, LO Q976, LY Q976 LO Q996 - Hyper CHIPLED LW Q18S LB Q993, LB Q99A, LB R99A - SideLED LS A670, LO A670, LY A670, LG A670, LP A670 LB A673, LV A673, LT A673, LW A673 LH A674 LY A675 LS A676, LA A676, LO A676, LY A676, LW A676 LS A679, LY A679, LG A679 - Hyper Micro SIDELED® LS Y876, LA Y876, LO Y876, LY Y876 LT Y87S - SmartLED LW L88C, LW L88S LB L89C, LB L89S, LG L890 LS L89K, LO L89K, LY L89K LS L896, LA L896, LO L896, LY L896 - TOPLED LS T670, LO T670, LY T670, LG T670, LP T670 LSG T670, LSP T670, LSY T670, LOP T670, LYG T670 LG T671, LOG T671, LSG T671 LB T673, LV T673, LT T673, LW T673 LH T674 LS T676, LA T676, LO T676, LY T676, LB T676, LH T676, LSB T676, LW T676 LB T67C, LV T67C, LT T67C, LS T67K, LO T67K, LY T67K, LW E67C LS E67B, LA E67B, LO E67B, LY E67B, LB E67C, LV E67C, LT E67C LW T67C LS T679, LY T679, LG T679 LS T770, LO T770, LY T770, LG T770, LP T770 LB T773, LV T773, LT T773, LW T773 LH T774 LS E675, LA E675, LY E675, LS T675 LS T776, LA T776, LO T776, LY T776, LB T776 LHGB T686 LT T68C, LB T68C - Hyper Mini TOPLED® LB M676 - Mini TOPLED Santana® LG M470 LS M47K, LO M47K, LY M47K Source: http://www.osram.convergy.de LUXEON: - LUMILED® LXK2-PW12-R00, LXK2-PW12-S00, LXK2-PW14-U00, LXK2-PW14-V00 LXK2-PM12-R00, LXK2-PM12-S00, LXK2-PM14-U00 LXK2-PE12-Q00, LXK2-PE12-R00, LXK2-PE12-S00, LXK2-PE14-T00, LXK2-PE14-U00 LXK2-PB12-K00, LXK2-PB12-L00, LXK2-PB12-M00, LXK2-PB14-N00, LXK2-PB14-P00, LXK2-PB14-Q00 LXK2-PR12-L00, LXK2-PR12-M00, LXK2-PR14-Q00, LXK2-PR14-R00 LXK2-PD12-Q00, LXK2-PD12-R00, LXK2-PD12-S00 LXK2-PH12-R00, LXK2-PH12-S00 LXK2-PL12-P00, LXK2-PL12-Q00, LXK2-PL12-R00 Source: www.luxeon.com KINGBRIGHT: KA-3528ASYC Source: www.kingbright.com
Q1 Q2 Q101 Q102 = transistor-power:IRF540: HEXFET Power MOSFET
Q201 = transistor-small-signal:BSS123: N-CHANNEL MOS FET
R1-R3 R7 R14-R16 R20 R32-R39 R117-R124 = MDT_R:R; PACKAGE: 2512; POWER: 1; TOL: 1%
R4-R6 R13 R17-R19 R26 R101-R106 R108 R110 R302 R303 = MDT_R:R; PACKAGE: 1206; POWER: 0.25; TOL: 1%
R8-R12 R21-R25 R27-R31 R41 R107 R109 R111-R116 R125 R126 R202-R207 R209 R211 R212 R214 R216-R219 = MDT_R:R; PACKAGE: 0805
R40 = MDT_R:R; PACKAGE: 1206; POWER: 0.25; TOL: 1%; VALUE: 1K
R201 = rcl:R-TRIMM: Trimm resistor
R301 = resistor:R-US_: RESISTOR, American symbol
T1 T2 = MDT_TRAFO:HP4_TRAFO
T201 = transistor:*-NPN-: NPN Transistror BF959 corrected 2008.03.06
T202 = transistor:*-PNP-: PNP Transistror
TP1-TP19 = MDT_CON:PROBE_TP
X1 = con-wago-500:W237-102: WAGO SCREW CLAMP; MPN: 237-102; OC_FARNELL: unknown; OC_NEWARK: 70K9898
X101 = MDT_HEATSINK:HEATSINK_OMNI_DUAL

## Net classes
1 32W_20S: width 0.813 mm, drill 0.6 mm, clearance 0.508 mm
2 32W_30S: width 0.813 mm, drill 0.6 mm, clearance 0.762 mm
3 50W_30S: width 1.27 mm, drill 0.6 mm, clearance 0.762 mm

## Board
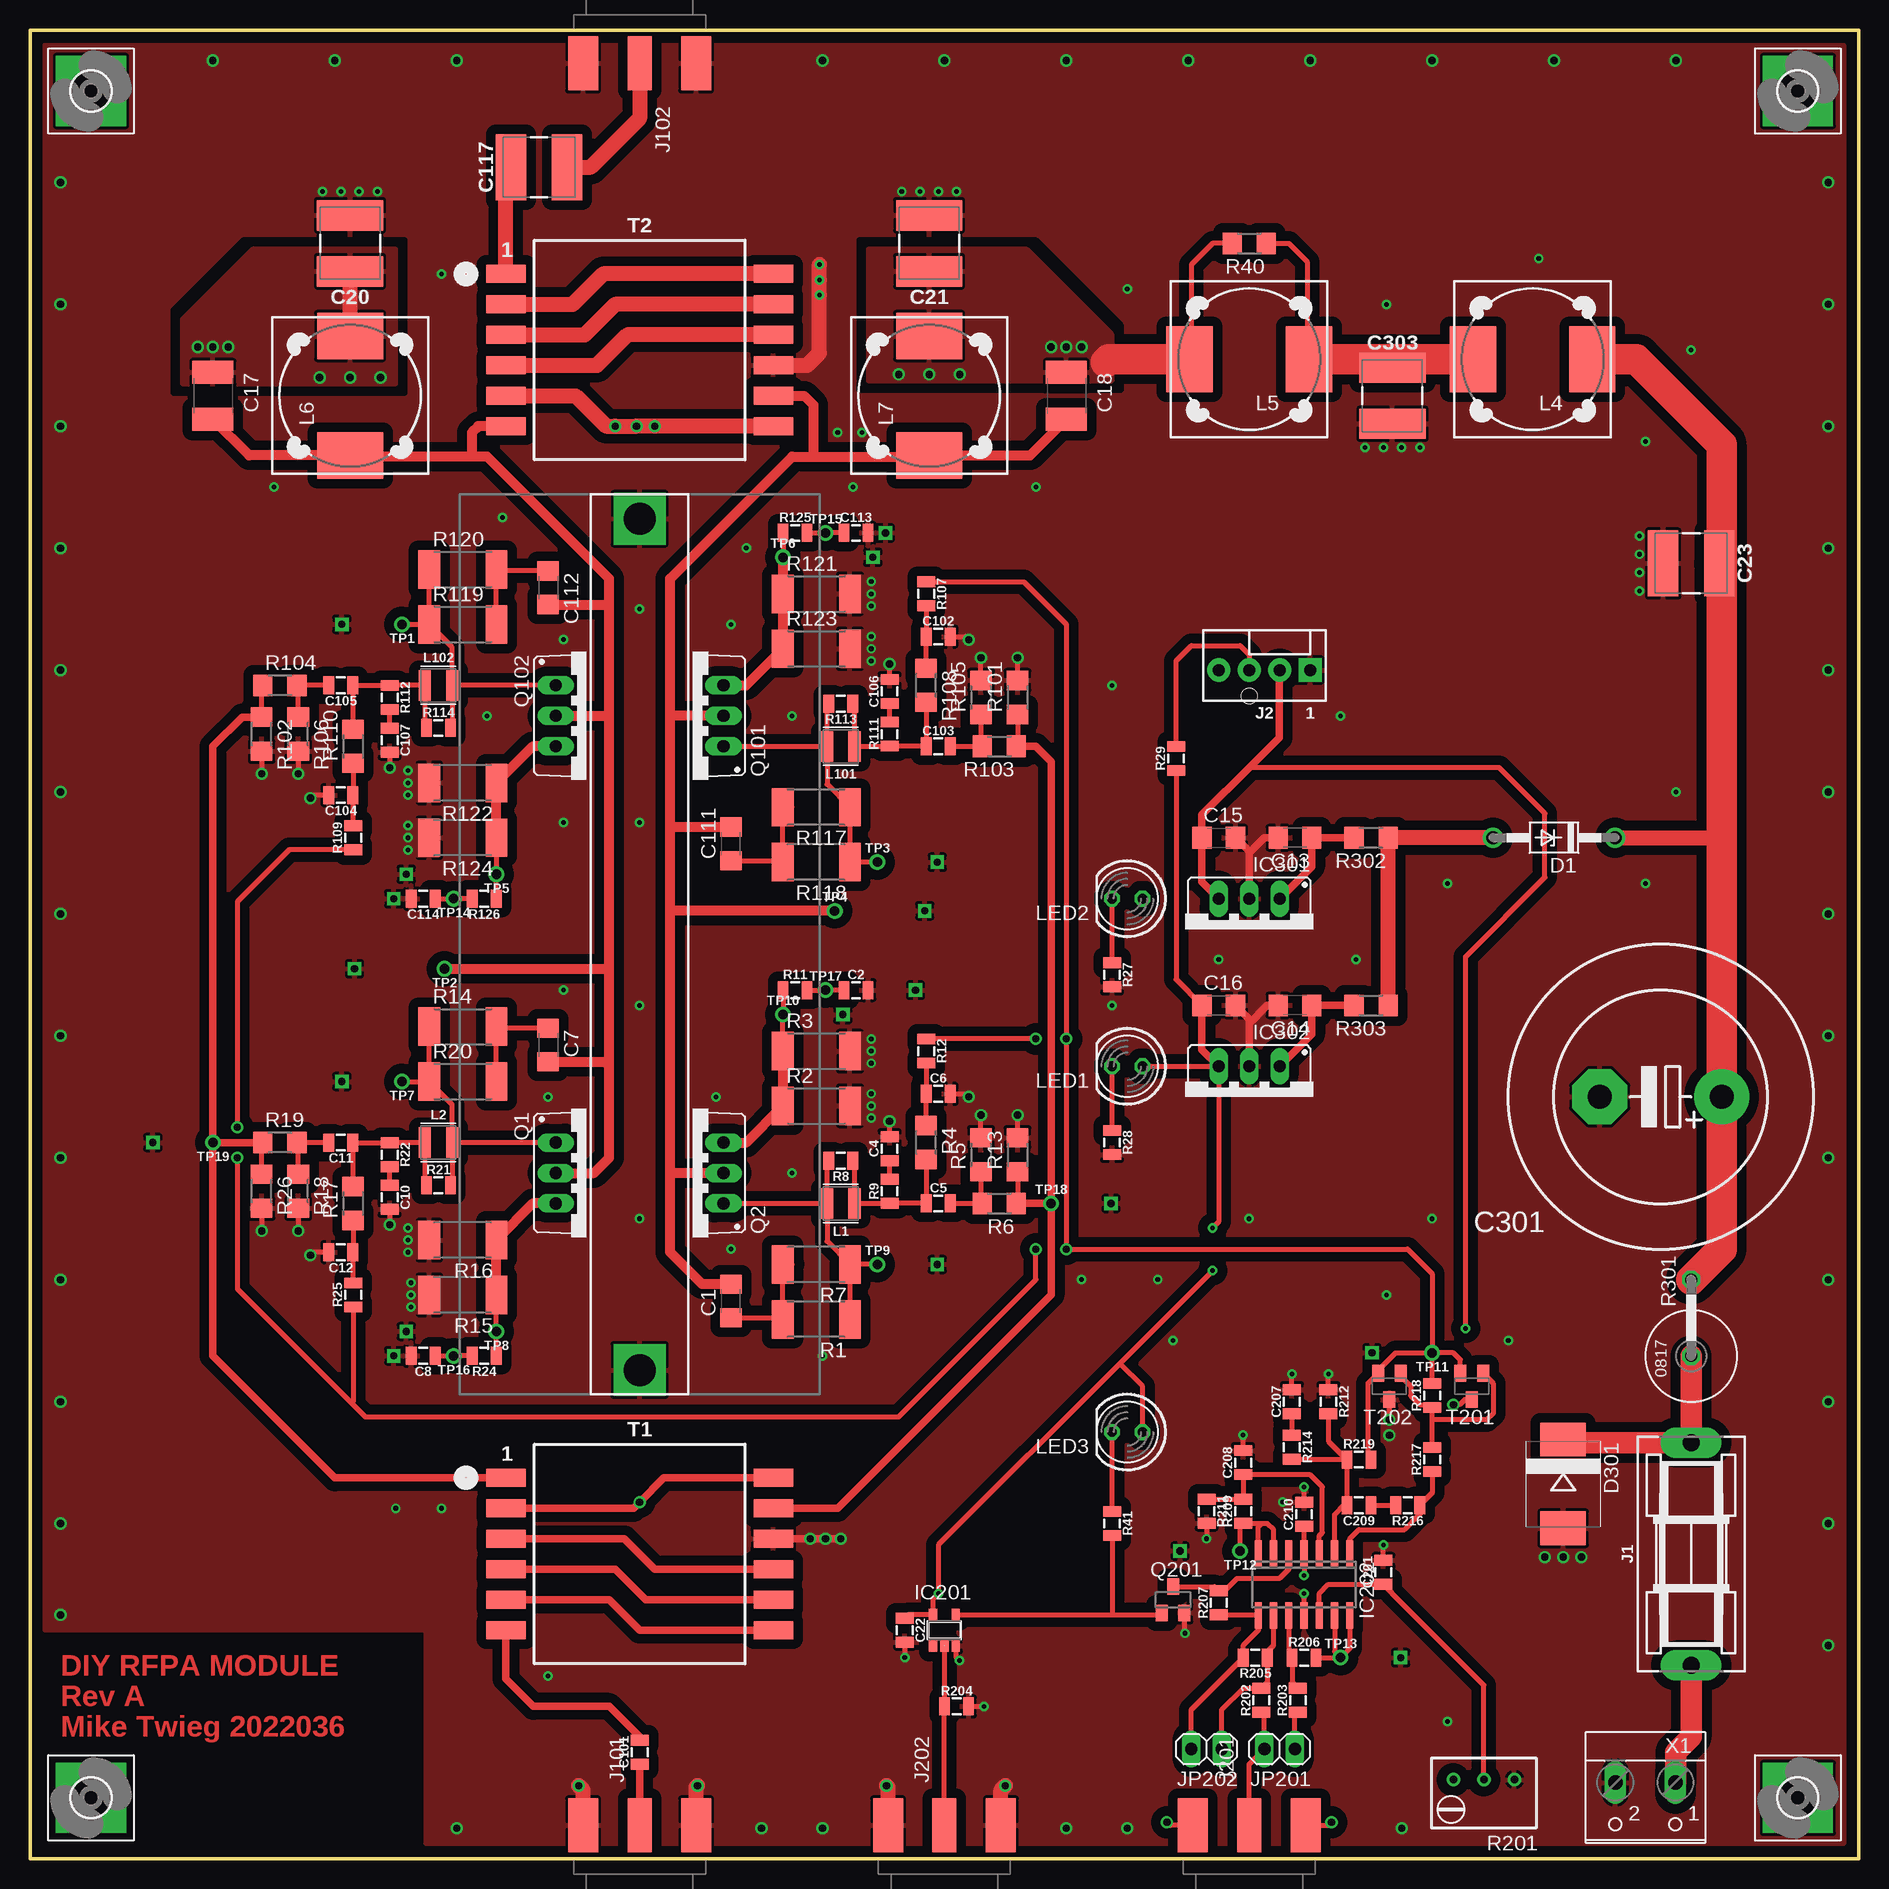
[diagram p4: board, top side]
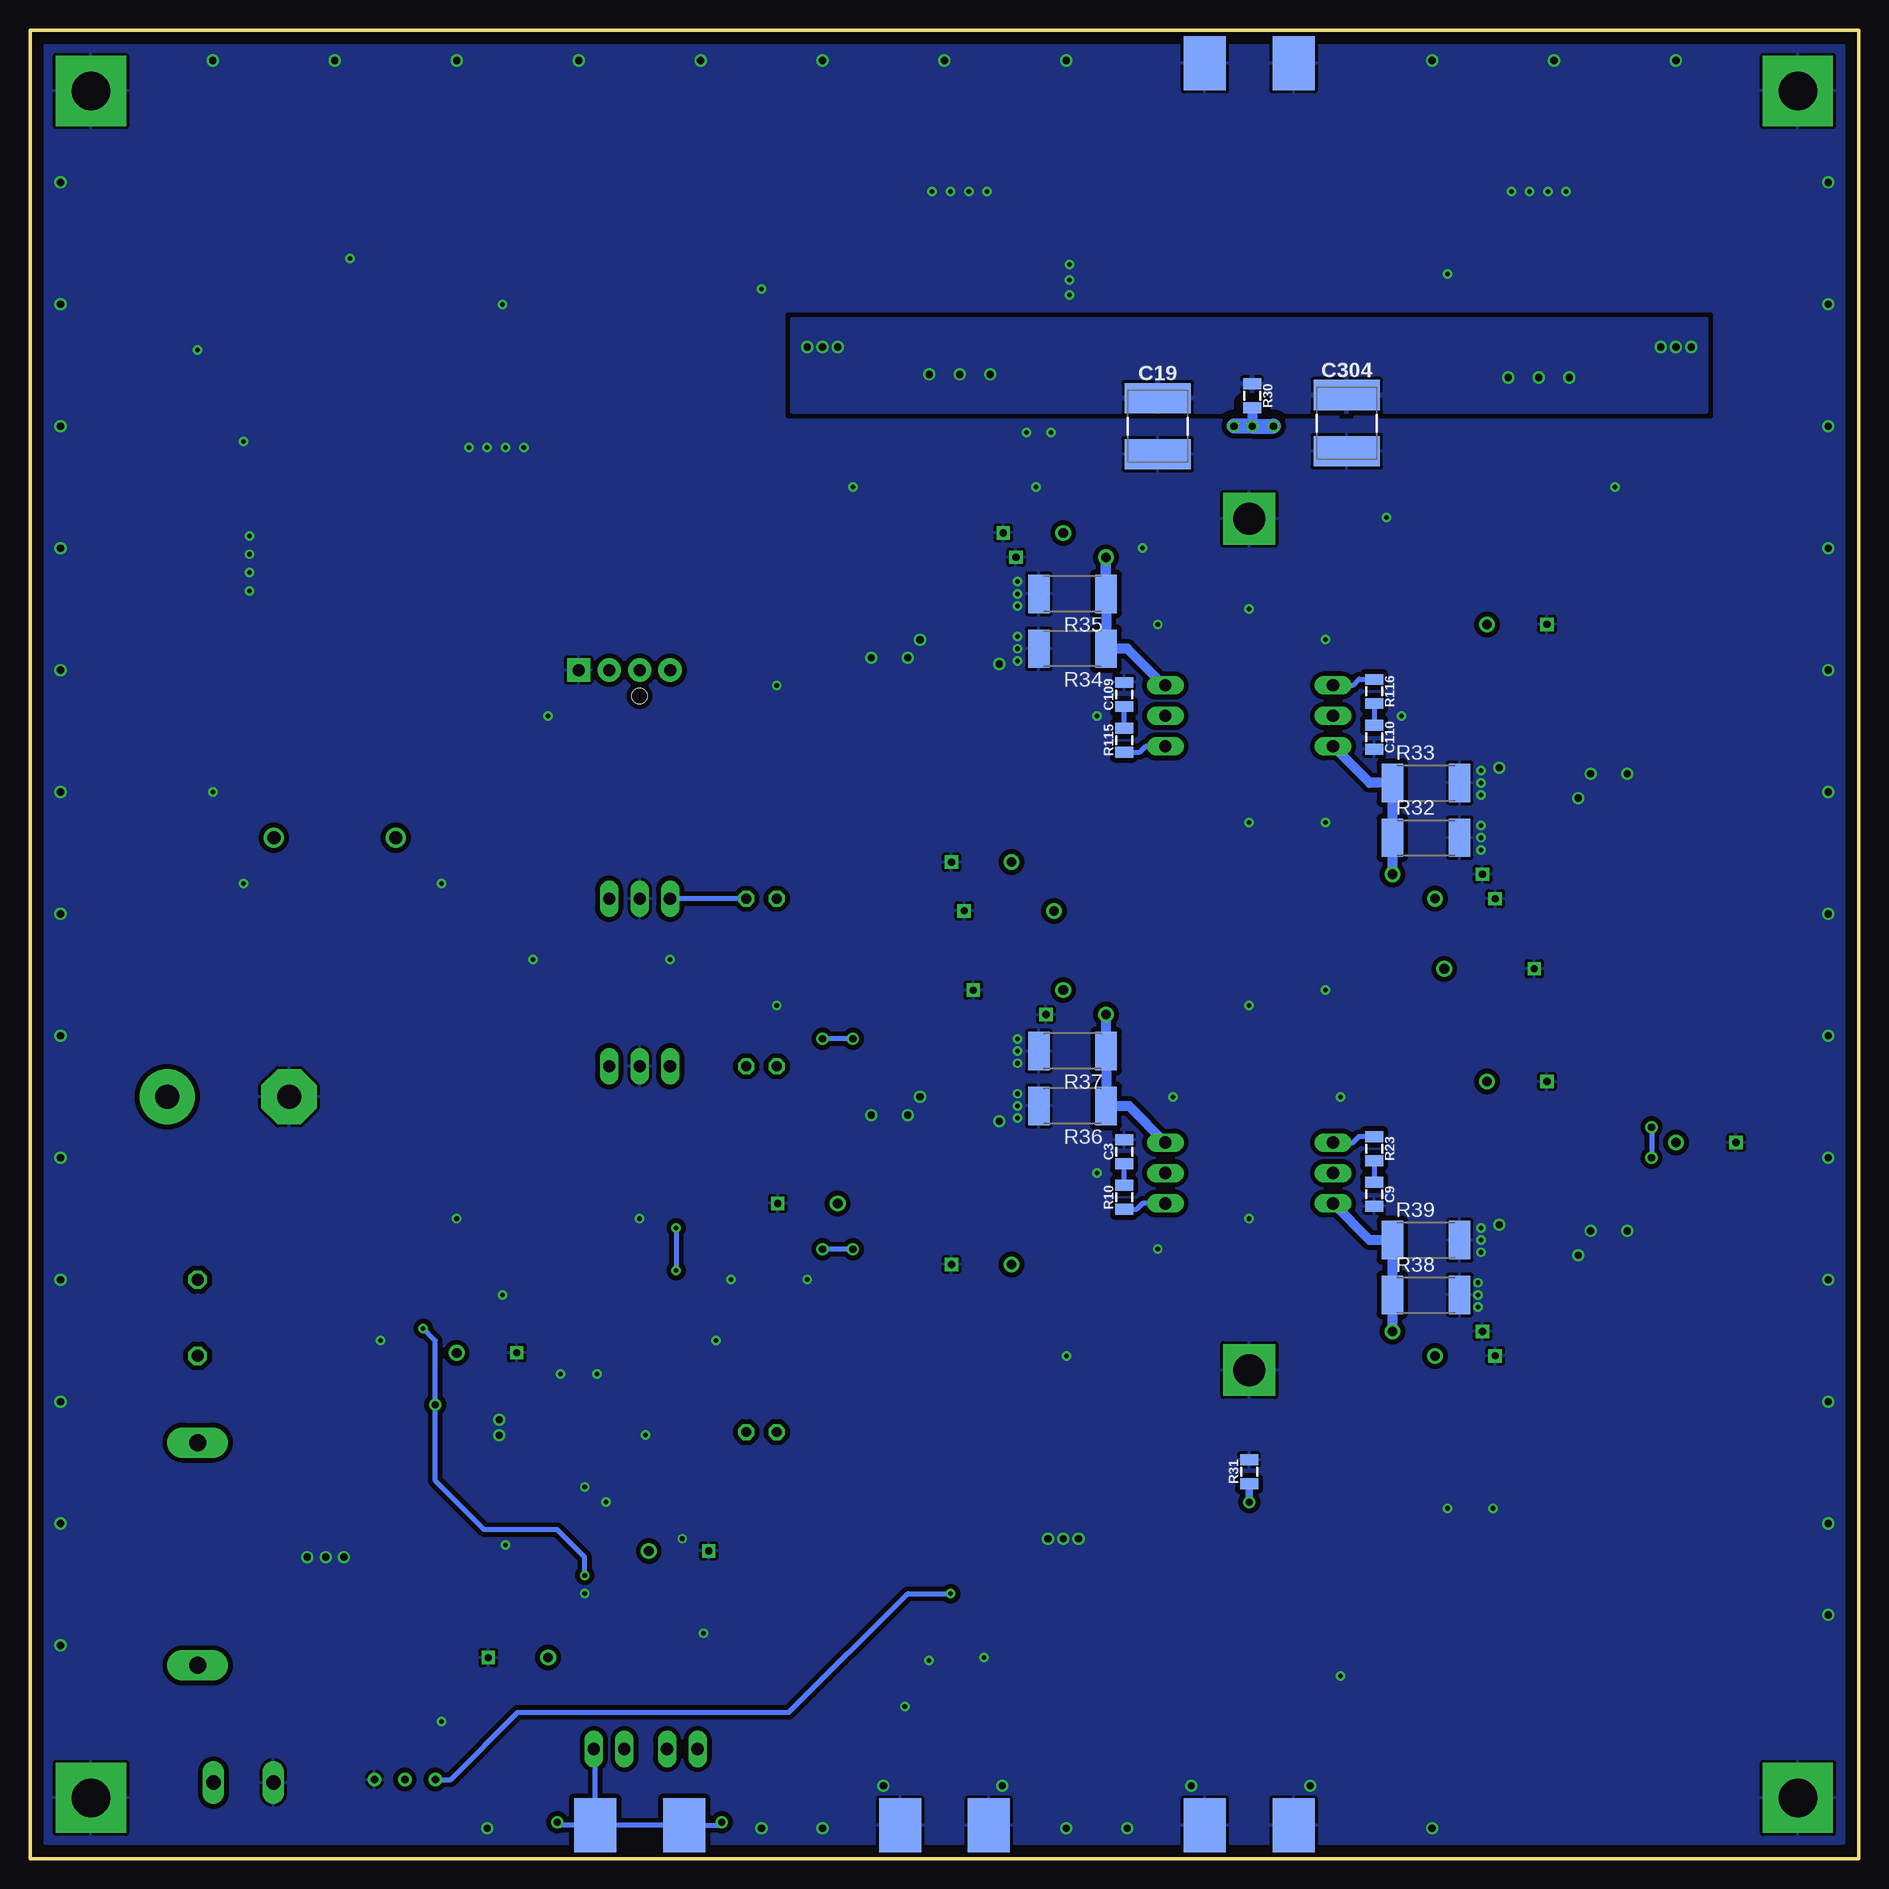
[diagram p5: board, bottom side, seen from below]

Size 152.4 x 152.4 mm. Coordinates in mm from the lower left corner, seen from the top.
Outline: 0,0 152.4,0 152.4,152.4 0,152.4 0,0
Copper layers (1+2*15+16): Top 0.035mm / dielectric 1.5mm / Route2 0.035mm / dielectric 0.15mm / Route15 0.035mm / dielectric 0.2mm / Bottom 0.035mm
Design rules "default *": minimum track width 10mil, minimum drill 15mil, track to track 8mil, track to pad 8mil, pad to pad 8mil, via to via 8mil, smd to smd 8mil, copper to edge 10mil, drill to drill 8mil, minimum pad ring 10mil, minimum via ring 8mil, stop-mask expansion 4mil, vias tented up to drill 0mil, thermal gap 10mil

### Footprints (pad centres in the part's own frame; a part is rotated, then mirrored left to right if it is on the bottom)
C1206 = smd 1.6 x 1.8: 1 -1.4,0; 2 1.4,0
0805_IPC-7351B = smd 0.9 x 1.5: 1 -1,0; 2 1,0
C1812 = smd 1.9 x 3.4: 1 -1.95,0; 2 1.95,0
C2220_CKG57N = smd 2.53 x 5.51: 1 -2.335,0; 2 2.335,0
EB25D = drill 2.007 pad 4.597: + -5.08,0 | drill 2.007 pad 4.597 octagon: - 5.08,0
DO41Z10 = drill 1.118: A 5.08,0; C -5.08,0
SMC = smd 2.8 x 3.8: A 3.7,0; C -3.7,0
3,2-PAD-SQUARE = drill 3.2 pad 5.842 square: B3,2 0,0
SOT23-5 = smd 0.69 x 0.99: 1 -0.95,-1.29; 2 0,-1.29; 3 0.95,-1.29; 4 0.95,1.3; 5 -0.95,1.3
SO14 = smd 0.6 x 2.2: 1 -3.81,-2.6; 2 -2.54,-2.6; 3 -1.27,-2.6; 4 0,-2.6; 5 1.27,-2.6; 6 2.54,-2.6; 7 3.81,-2.6; 8 3.81,2.6; 9 2.54,2.6; 10 1.27,2.6; 11 0,2.6; 12 -1.27,2.6; 13 -2.54,2.6; 14 -3.81,2.6
78XXS = drill 1.016 long: GND 0,-2.54; IN -2.54,-2.54; OUT 2.54,-2.54
02540121Z = drill 1.4 pad 2.54 long: 1 -9.271,0; 2 9.271,0
47053-1000 = drill 1 pad 1.93 square: 1 3.81,0 | drill 1 pad 1.93: 2 1.27,0; 3 -1.27,0; 4 -3.81,0 | hole 1.3: -1.27,-2.16
BNC_EDGE = smd 4.5 x 2: C 0.25,0 | smd 4.5 x 2.5: G1 0.25,4.7; G4 0.25,-4.7 | smd 4.5 x 3.5 bottom: G2 0.25,3.7; G3 0.25,-3.7
1X02 = drill 1.016 long: 1 -1.27,0; 2 1.27,0
L1008 = smd 1.02 x 2.54: 1 -1.145,0; 2 1.145,0
DR127 = smd 3.85 x 5.5: 1 -4.975,0; 2 4.975,0
LED5MM = drill 0.813 octagon: A -1.27,0; K 1.27,0
TO220BV = drill 1.016 long: D 0,-2.54; G -2.54,-2.54; S 2.54,-2.54
SOT23 = smd 1 x 1.4: 1 -0.95,-1.1; 2 0.95,-1.1; 3 0,1.1
R2512 = smd 1.8 x 3.2: 1 -2.8,0; 2 2.8,0
R1206 = smd 1.6 x 1.803: 1 -1.422,0; 2 1.422,0
RTRIM3299W = drill 0.61: 1 1.27,-2.54; 2 1.27,0; 3 1.27,2.54
P0817V = drill 1.016 octagon: 1 -5.08,0; 2 1.27,0
HP4 = smd 3.3 x 1.5: 1 -11.15,6.35; 2 -11.15,3.81; 3 -11.15,1.27; 4 -11.15,-1.27; 5 -11.15,-3.81; 6 -11.15,-6.35; 7 11.15,-6.35; 8 11.15,-3.81; 9 11.15,-1.27; 10 11.15,1.27; 11 11.15,3.81; 12 11.15,6.35
SOT23-BEC = smd 1 x 1.4: B -0.95,-1.1; C 0,1.1; E 0.95,-1.1
PROBE_TP_5MM = drill 0.6 square: GND 5,0 | drill 0.8: TP 0,0
PROBE_TP_7P5MM = drill 0.6 square: GND 7.5,0 | drill 0.8: TP 0,0
W237-102 = drill 1.194 long: 1 -2.5,-1.27; 2 2.5,-1.27
OMNI-UNI-30-75-D = drill 2.667 pad 4.318 square: P1 0,35.47; P2 0,-35.47

### Placement (x,y rotation side)
C1  58.42,46.48 90 top
C2  68.83,72.39 0 top
C3  61.21,58.93 90 bottom
C4  71.63,59.18 90 top
C5  75.69,54.61 0 top
C6  75.69,63.75 0 top
C7  43.18,67.82 270 top
C8  32.77,41.91 180 top
C9  40.39,55.37 270 bottom
C10  29.97,55.12 270 top
C11  25.91,59.69 180 top
C12  25.91,50.55 180 top
C13  105.41,85.09 180 top
C14  105.41,71.12 180 top
C15  99.06,85.09 0 top
C16  99.06,71.12 0 top
C17  15.24,121.92 270 top
C18  86.36,121.92 270 top
C19  58.42,119.38 270 bottom
C20  26.67,134.62 90 top
C21  74.93,134.62 90 top
C22  72.9,19.05 270 top
C23  138.43,107.95 180 top
C101  50.8,8.89 90 top
C102  75.69,101.85 0 top
C103  75.69,92.71 0 top
C104  25.91,88.65 180 top
C105  25.91,97.79 180 top
C106  71.63,97.28 90 top
C107  29.97,93.22 270 top
C109  61.21,97.03 90 bottom
C110  40.39,93.47 270 bottom
C111  58.42,84.58 90 top
C112  43.18,105.92 270 top
C113  68.83,110.49 0 top
C114  32.77,80.01 180 top
C117  42.42,140.97 0 top
C201  112.78,23.88 90 top
C207  105.16,38.1 90 top
C208  101.09,33.02 90 top
C209  110.74,29.46 180 top
C210  106.17,28.7 90 top
C301  135.89,63.5 180 top
C303  113.54,121.92 270 top
C304  42.67,119.63 270 bottom
D1  127,85.09 180 top
D301  127.76,31.24 270 top
H1  5.08,5.08 0 top
H2  147.32,5.08 0 top
H3  147.32,147.32 0 top
H4  5.08,147.32 0 top
IC201  76.2,19.05 0 top
IC202  106.17,22.86 180 top
IC301  101.6,77.47 180 top
IC302  101.6,63.5 180 top
J1  138.43,25.4 90 top
J2  102.87,99.06 0 top
J101  50.8,2.54 90 top
J102  50.8,149.86 270 top
J201  101.6,2.54 90 top
J202  76.2,2.54 90 top
JP201  104.14,9.14 180 top
JP202  98.04,9.14 180 top
L1  67.56,54.61 180 top
L2  34.04,59.69 0 top
L4  125.22,124.97 180 top
L5  101.6,124.97 180 top
L6  26.67,121.92 90 top
L7  74.93,121.92 90 top
L101  67.56,92.71 180 top
L102  34.04,97.79 0 top
LED1  91.44,66.04 180 top
LED2  91.44,80.01 180 top
LED3  91.44,35.56 180 top
Q1  46.35,57.15 270 top
Q2  55.24,57.15 90 top
Q101  55.24,95.25 90 top
Q102  46.35,95.25 270 top
Q201  95.25,21.59 0 top
R1  65.53,44.96 180 top
R2  65.53,62.74 0 top
R3  65.53,67.31 0 top
R4  74.68,59.69 270 top
R5  79.25,58.67 90 top
R6  80.77,54.61 180 top
R7  65.53,49.53 180 top
R8  67.56,58.17 180 top
R9  71.63,55.63 90 top
R10  61.21,55.12 90 bottom
R11  63.75,72.39 0 top
R12  74.68,67.31 270 top
R13  82.3,58.67 90 top
R14  36.07,69.34 0 top
R15  36.07,46.99 180 top
R16  36.07,51.56 180 top
R17  26.92,54.61 90 top
R18  22.35,55.63 270 top
R19  20.83,59.69 0 top
R20  36.07,64.77 0 top
R21  34.04,56.13 0 top
R22  29.97,58.67 270 top
R23  40.39,59.18 270 bottom
R24  37.85,41.91 180 top
R25  26.92,46.99 90 top
R26  19.3,55.63 270 top
R27  90.17,73.66 270 top
R28  90.17,59.69 270 top
R29  95.5,91.69 90 top
R30  50.55,121.92 270 bottom
R31  50.8,32.26 90 bottom
R32  36.07,85.09 0 bottom
R33  36.07,89.66 0 bottom
R34  65.53,100.84 180 bottom
R35  65.53,105.41 180 bottom
R36  65.53,62.74 180 bottom
R37  65.53,67.31 180 bottom
R38  36.07,46.99 0 bottom
R39  36.07,51.56 0 bottom
R40  101.6,134.62 180 top
R41  90.17,27.94 270 top
R101  82.3,96.77 90 top
R102  19.3,93.73 270 top
R103  80.77,92.71 180 top
R104  20.83,97.79 0 top
R105  79.25,96.77 90 top
R106  22.35,93.73 270 top
R107  74.68,105.41 270 top
R108  74.68,97.79 270 top
R109  26.92,85.09 90 top
R110  26.92,92.71 90 top
R111  71.63,93.73 90 top
R112  29.97,96.77 270 top
R113  67.56,96.27 180 top
R114  34.04,94.23 0 top
R115  61.21,93.22 90 bottom
R116  40.39,97.28 270 bottom
R117  65.53,87.63 180 top
R118  65.53,83.06 180 top
R119  36.07,102.87 0 top
R120  36.07,107.44 0 top
R121  65.53,105.41 0 top
R122  36.07,89.66 180 top
R123  65.53,100.84 0 top
R124  36.07,85.09 180 top
R125  63.75,110.49 0 top
R126  37.85,80.01 180 top
R201  121.16,5.33 90 top
R202  102.62,13.21 90 top
R203  105.66,13.21 90 top
R204  77.22,12.7 0 top
R205  102.11,16.76 180 top
R206  106.17,16.76 0 top
R207  99.06,21.34 90 top
R209  101.09,28.96 90 top
R211  98.04,28.96 270 top
R212  108.2,38.1 270 top
R214  105.16,34.29 270 top
R216  114.81,29.46 180 top
R217  116.84,33.27 90 top
R218  116.84,38.61 90 top
R219  110.74,33.27 0 top
R301  138.43,46.99 90 top
R302  111.76,85.09 180 top
R303  111.76,71.12 180 top
T1  50.8,25.4 0 top
T2  50.8,125.73 0 top
T201  120.14,39.37 180 top
T202  113.28,39.37 180 top
TP1  30.99,102.87 180 top
TP2  34.54,74.17 180 top
TP3  70.61,83.06 0 top
TP4  67.06,78.99 0 top
TP5  38.86,82.04 180 top
TP6  62.74,108.46 0 top
TP7  30.99,64.77 180 top
TP8  38.86,43.94 180 top
TP9  70.61,49.53 0 top
TP10  62.74,70.36 0 top
TP11  116.84,42.16 180 top
TP12  100.84,25.65 180 top
TP13  109.22,16.76 0 top
TP14  35.31,80.01 180 top
TP15  66.29,110.49 0 top
TP16  35.31,41.91 180 top
TP17  66.29,72.39 0 top
TP18  85.09,54.61 0 top
TP19  15.24,59.69 180 top
X1  134.62,5.08 180 top
X101  50.8,76.2 0 top

### Tracks (layer width: path | path; a pad name or v marks a point on that pad's centre or on a via)
+5V  (via drill 0.38)
  Top 0.406: R29.1 95.5,73.28 C16.1 | C22.1 73.2,20.35 IC201.5 75.25,21.66 v75.69,22.1 75.69,26.16 90.81,41.27 | v98.55,52.58 99.06,53.09 IC302.OUT LED1.A | v98.55,49.02 90.81,41.27 | LED3.A 92.71,39.37 90.81,41.27
  Top 0.61: C16.1 97.66,67.44 IC302.OUT
  Bottom 0.406: R201.3 117.35,6.6 111.76,12.19 89.15,12.19 79.25,22.1 v75.69,22.1 | v98.55,52.58 v98.55,49.02
+12V  (via drill 0.38, 0.6)
  Top 0.406: C210.1 IC202.4 v106.17,23.62 | T201.C 119.55,38.27 119.13,37.85 v118.62,37.85 | v119.63,44.2 119.63,75.18 126.24,81.79 126.24,87.12 122.43,90.93 101.85,90.93 101.73,91.06
  Top 0.61: IC301.OUT 97.66,81.41 C15.1 97.66,86.99 101.73,91.06 104.09,93.42 104.09,99.01 J2.2
  Bottom 0.406: v106.17,23.62 106.17,25.15 108.46,27.43 114.55,27.43 118.62,31.5 v118.62,37.85 118.62,43.18 v119.63,44.2 | LED2.A IC301.OUT
ABN1
  Top 0.406: R13.1 82.3,54.71 R6.1 | R101.1 82.3,92.81 R103.1
  Top 0.61: R103.1 83.82,92.71 85.09,91.44 TP18.TP | TP18.TP 85.09,46.99 67.31,29.21 T1.11 | R6.1 TP18.TP
ABP1
  Top 0.406: R102.1 19.3,97.69 R104.1 | R26.1 19.3,59.59 R19.1
  Top 0.61: R102.1 17.68,95.15 15.24,92.71 TP19.TP | TP19.TP 15.24,41.91 25.4,31.75 T1.1 | R19.1 TP19.TP
AN2
  Top 0.406: C103.2 R103.2 79.25,92.81 R105.1
AN3
  Top 0.406: R113.1 68.71,96.12 L101.1 71.61,92.71 R111.1 71.64,92.71 C103.1 74.68,92.73 R108.2
AN4
  Top 0.406: Q101.G L101.2 | L101.2 66.42,96.12 R113.2 | L101.2 66.42,89.54 R117.1 R118.1 TP3.TP
  Bottom 0.406: R115.1 59.93,92.22 59.44,92.71 Q101.G
AN5
  Top 0.406: R125.1 62.75,108.47 TP6.TP
  Top 0.813: Q101.S 59.68,97.79 R34.1 R35.1 TP6.TP
  Bottom 0.813: R35.1 62.75,105.43 62.75,108.44 TP6.TP R35.1 R34.1 60.96,100.84 57.91,97.79 Q101.S
AN6
  Top 0.406: R125.2 TP15.TP C113.1
AP2
  Top 0.406: C105.2 R104.2 22.35,97.69 R106.1
AP3
  Top 0.406: R114.1 32.89,94.38 L102.1 29.99,97.79 R112.1 29.96,97.79 C105.1 26.92,97.77 R110.2
AP4
  Top 0.406: Q102.G L102.2 | L102.2 35.18,94.38 R114.2 | L102.2 35.18,100.96 R119.1 | R119.1 R120.1 | TP1.TP R119.1
  Bottom 0.406: Q102.G 43.8,97.77 42.18,97.77 41.66,98.3 40.4,98.3 R116.1
AP5
  Top 0.406: R32.1 TP5.TP 38.85,82.03 R126.1
  Top 0.813: R32.1 R33.1 41.92,92.71 Q102.S
  Bottom 0.813: TP5.TP R32.1 R33.1 40.77,89.66 Q102.S
AP6
  Top 0.406: C114.1 TP14.TP R126.2
BN2
  Top 0.406: C5.2 R6.2 79.25,54.71 R5.1
BN3
  Top 0.406: R8.1 68.71,58.02 L1.1 71.61,54.61 R9.1 71.64,54.61 C5.1 74.68,54.63 R4.2
BN4
  Top 0.406: Q2.G L1.2 | L1.2 66.42,58.02 R8.2 | R7.1 R1.1 | L1.2 66.42,51.44 R7.1 | TP9.TP R7.1
  Bottom 0.406: R10.1 60.18,54.12 59.69,54.61 Q2.G
BN5
  Top 0.406: R37.1 TP10.TP 62.75,70.37 R11.1
  Top 0.813: Q2.S 59.68,59.69 R36.1 R37.1
  Bottom 0.813: TP10.TP R37.1 R36.1 | R36.1 60.83,62.74 Q2.S
BN6
  Top 0.406: C2.1 TP17.TP R11.2
BP2
  Top 0.406: C11.2 R19.2 22.35,59.59 R18.1
BP3
  Top 0.406: R21.1 32.89,56.28 L2.1 29.99,59.69 R22.1 29.96,59.69 C11.1 26.92,59.67 R17.2
BP4
  Top 0.406: Q1.G L2.2 | L2.2 35.18,56.28 R21.2 | L2.2 35.18,62.86 R20.1 | R20.1 R14.1 | TP7.TP R20.1
  Bottom 0.406: R23.1 41.67,60.18 42.16,59.69 Q1.G
BP5
  Top 0.406: R38.1 38.85,46.97 R24.1 38.85,43.93 TP8.TP
  Top 0.813: R38.1 R39.1 41.92,54.61 Q1.S
  Bottom 0.813: TP8.TP R38.1 R39.1 40.77,51.56 Q1.S
BP6
  Top 0.406: C8.1 TP16.TP R24.2
DRAINS_NEG
  Top 0.813: Q2.D 53.34,57.15 | 53.34,57.15 53.34,78.74 | 53.34,78.74 53.34,86.11 | 53.34,86.11 53.34,95 | 53.34,95 53.34,106.68 63.5,116.84 65.53,116.84 | C18.2 83.33,116.94 L7.1 74.83,116.84 65.53,116.84 | Q101.D 53.59,95.25 53.34,95 | T2.8 64.52,121.92 65.28,121.16 65.28,117.09 65.53,116.84 | TP4.TP 53.59,78.99 53.34,78.74 | C111.2 53.46,85.98 53.34,86.11 | C1.2 56,47.88 53.34,50.55 53.34,57.15
DRAINS_POS
  Top 0.813: Q1.D 46.99,57.15 48.26,58.42 48.26,66.04 | 48.26,66.04 48.26,73.91 | 48.26,73.91 48.26,95.5 | 48.26,95.5 48.26,104.39 | 48.26,104.39 48.26,106.68 38.1,116.84 36.58,116.84 | C17.2 18.27,116.94 L6.1 26.77,116.84 36.58,116.84 | Q102.D 48.01,95.25 48.26,95.5 | T2.6 37.34,119.38 36.83,118.87 36.83,117.09 36.58,116.84 | TP2.TP 48.01,74.17 48.26,73.91 | C112.2 48.14,104.52 48.26,104.39 | C7.2 47.88,66.42 48.26,66.04
GBIAS  (via drill 0.6)
  Top 0.406: R107.1 82.82,106.41 86.36,102.87 v86.36,68.33 v86.36,50.8 114.81,50.8 116.84,48.77 TP11.TP | R109.1 26.92,84.07 21.59,84.07 17.27,79.76 v17.27,60.96 | v17.27,58.42 17.27,47.5 26.8,37.97 | 26.8,37.97 27.94,36.83 72.39,36.83 83.82,48.26 v83.82,50.8 | R25.1 26.92,38.1 26.8,37.97 | T201.E 119.19,41.59 118.62,42.16 TP11.TP | R218.2 TP11.TP | TP11.TP 113.79,42.16 112.33,40.71 T202.E 111.51,39.64 111.51,33.27 R219.2 | v83.82,68.33 74.69,68.33 R12.1
  Bottom 0.406: v83.82,68.33 v86.36,68.33 | v17.27,60.96 v17.27,58.42 | v83.82,50.8 v86.36,50.8
GND  (via drill 0.38, 0.6)
  Top 0.406: C4.2 v71.63,61.47 | R5.2 v79.25,61.98 | R13.2 v82.3,61.98 | C6.2 77.98,63.75 v78.23,63.5 | C10.2 v29.97,52.83 | C12.2 23.62,50.55 v23.37,50.29 | R18.2 v22.35,52.32 | R26.2 v19.3,52.32 | R106.2 v22.35,90.42 | R102.2 v19.3,90.42 | C104.2 23.62,88.65 v23.37,88.39 | C107.2 v29.97,90.93 | R101.2 v82.3,100.08 | R105.2 v79.25,100.08 | C102.2 77.98,101.85 v78.23,101.6 | C106.2 v71.63,99.57 | IC202.11 v106.17,22.1 | C208.2 v101.09,35.31 | R211.2 v98.04,26.67 | C210.2 v106.17,30.99 | C207.2 v105.16,40.39 | R212.1 v108.2,40.39 | C201.2 v112.78,26.16 | IC201.3 77.15,16.83 v77.47,16.51 | R204.2 v79.5,12.7 | Q201.2 96.2,18.86 v96.27,18.8 | C22.2 v72.9,16.76 | T202.C v113.28,36.58
  Top 0.61: IC301.GND 101.6,83.82 | 101.6,83.82 101.6,83.95 C15.2 | C13.2 102.87,85.09 101.6,83.82 | IC302.GND 101.6,69.6 | 101.6,69.6 101.6,69.98 C16.2 | C14.2 103.12,71.12 101.6,69.6 | T1.10 v65.02,26.67 v66.29,26.67 v67.56,26.67
  Top 1.27: T2.9 64.77,124.46 65.79,125.48 v65.79,130.3 v65.79,131.57 v65.79,132.84 | J101.G1 46.1,5.72 v45.72,6.1 | J101.G4 55.5,5.97 v55.63,6.1 | J202.G1 71.5,5.97 v71.37,6.1 | J202.G4 80.9,5.72 v81.28,6.1
  other vias: 31.5,52.58 31.5,51.56 31.5,50.55 31.75,48.01 31.75,46.99 31.75,45.97 31.5,90.68 31.5,89.66 31.5,88.65 31.5,86.11 31.5,85.09 31.5,84.07 70.1,99.82 70.1,100.84 70.1,101.85 70.1,104.39 70.1,105.41 70.1,106.43 70.1,61.72 70.1,62.74 70.1,63.75 70.1,66.29 70.1,67.31 70.1,68.33 27.43,138.94 28.96,138.94 25.91,138.94 24.38,138.94 134.11,108.71 134.11,110.24 134.11,107.19 134.11,105.66 112.78,117.6 111.25,117.6 114.3,117.6 115.82,117.6 75.69,138.94 77.22,138.94 74.17,138.94 72.64,138.94 126.24,25.15 127.76,25.15 129.29,25.15 104.39,29.72 113.28,35.31 15.24,149.86 25.4,149.86 35.56,149.86 66.04,149.86 76.2,149.86 86.36,149.86 96.52,149.86 106.68,149.86 116.84,149.86 127,149.86 137.16,149.86 2.54,139.7 2.54,129.54 2.54,119.38 2.54,109.22 2.54,99.06 2.54,88.9 2.54,78.74 2.54,68.58 2.54,58.42 2.54,48.26 2.54,38.1 2.54,27.94 2.54,20.32 35.56,2.54 60.96,2.54 66.04,2.54 86.36,2.54 91.44,2.54 114.3,2.54 149.86,139.7 149.86,129.54 149.86,119.38 149.86,109.22 149.86,99.06 149.86,88.9 149.86,78.74 149.86,68.58 149.86,58.42 149.86,48.26 149.86,38.1 149.86,27.94 149.86,17.78 90.17,71.12 99.06,74.93 110.49,74.93 118.11,81.28 116.84,53.34 101.6,53.34 87.63,48.26 93.98,48.26 43.18,15.24 30.48,29.21 34.29,29.21 50.8,86.36 50.8,71.12 50.8,53.34 50.8,104.14 39.37,111.76 58.42,102.87 68.58,114.3 83.82,114.3 20.32,114.3 34.29,132.08 91.44,130.81 113.03,129.54 125.73,133.35 138.43,125.73 134.62,118.11 109.22,95.25 90.17,97.79 137.16,88.9 134.62,81.28 123.19,43.18 113.03,46.99 95.25,43.18 118.11,11.43 44.45,86.36 44.45,72.39 43.18,63.5 63.5,57.15 58.42,50.8 66.04,41.91 57.15,63.5 63.5,95.25 59.69,109.22 44.45,101.6 38.1,95.25 67.31,118.87 69.34,118.87
  pour Bottom (isolate 0.406, rank 3): 1.27,1.27 151.13,1.27 151.13,151.13 1.27,151.13
  pour Top (no thermals): 31.24,53.09 34.04,53.09 34.04,50.04 31.24,50.04 30.99,50.29 30.99,52.83
  pour Top (no thermals): 31.5,48.51 34.29,48.51 34.29,45.47 31.5,45.47 31.24,45.72 31.24,48.26
  pour Top (no thermals): 31.24,91.19 34.04,91.19 34.04,88.14 31.24,88.14 30.99,88.39 30.99,90.93
  pour Top (no thermals): 31.24,86.61 34.04,86.61 34.04,83.57 31.24,83.57 30.99,83.82 30.99,86.36
  pour Top (no thermals): 70.36,99.31 67.56,99.31 67.56,102.36 70.36,102.36 70.61,102.11 70.61,99.57
  pour Top (no thermals): 70.36,103.89 67.56,103.89 67.56,106.93 70.36,106.93 70.61,106.68 70.61,104.14
  pour Top (no thermals): 70.36,61.21 67.56,61.21 67.56,64.26 70.36,64.26 70.61,64.01 70.61,61.47
  pour Top (no thermals): 70.36,65.79 67.56,65.79 67.56,68.83 70.36,68.83 70.61,68.58 70.61,66.04
  pour Top (isolate 0.813, rank 3): 151.13,1.27 33.02,1.27 33.02,19.05 1.27,19.05 1.27,151.13 151.13,151.13
N$1
  Top 0.406: IC202.1 109.98,26.67 110.74,27.43 114.55,27.43 115.82,28.7 115.82,29.45 R216.1 116.84,30.5 R217.1
N$2
  Top 0.406: R217.2 116.84,36.58 | 116.84,36.58 R218.1 116.84,37.85 115.82,37.85 115.06,38.61 115.06,39.37 114.23,40.2 T202.B | T201.B 121.18,40.39 121.18,40.37 121.92,39.62 121.92,37.08 121.41,36.58 116.84,36.58
N$3
  Top 0.406: J202.C 76.2,12.68 R204.1 76.22,17.74 IC201.2
N$4
  Top 0.406: 63.5,87.63 R117.2 R118.2 62.61,83.18 C111.1
N$5
  Top 0.406: R111.2 C106.1
N$6
  Top 0.406: IC202.6 103.63,27.43 103.12,27.94 102.62,27.94 | 102.62,27.94 101.11,27.94 R209.1 100.84,27.7 TP12.TP | IC202.7 102.36,27.69 102.62,27.94
N$7
  Top 0.406: C209.1 R216.2
N$8
  Top 0.406: R110.1 26.92,88.66 C104.1 26.92,88.63 R109.2
N$9
  Top 0.406: C207.1 R214.1
N$10
  Top 0.406: C107.1 R112.2
N$11
  Bottom 0.406: R116.2 C110.1
N$12
  Top 0.406: R119.2 R120.2 38.99,107.32 C112.1
N$13
  Top 0.406: R108.1 74.68,101.84 C102.1 74.68,101.87 R107.2
N$14
  Top 0.406: IC202.2 108.71,28.7 109.46,29.45 109.73,29.45 C209.2 R219.1 | R219.1 105.17,33.27 R214.2 | R212.2 108.2,34.81 R219.1
N$15
  Top 0.406: R211.1 R209.2 C208.1 101.11,32 106.68,32 107.7,30.99 107.7,27.18 107.44,26.92 IC202.3
N$16
  Top 0.406: R203.2 105.17,14.7 R206.1 104.9,17.03 IC202.10
N$17
  Bottom 0.406: R115.2 C109.1
N$18
  Top 0.406: JP202.2 96.77,12.43 R205.2 101.11,17.8 102.36,19.05 IC202.8 102.29,20.34 R207.1
N$19
  Top 0.406: IC202.9 103.63,17.78 103.11,17.26 R205.1 103.11,14.7 R202.2 102.6,14.22 101.09,14.22 99.31,12.45 JP202.1
N$20
  Top 0.406: R202.1 102.87,11.95 JP201.2 101.6,7.87 J201.C
N$21  (via drill 0.6)
  Top 0.406: JP201.1 105.41,11.95 R203.1 | J201.G1 95,2.79 v94.74,3.05 | J201.G4 108.2,2.79 v108.46,3.05
  Bottom 0.406: J201.G3 105.3,9.03 JP201.1 | J201.G3 J201.G2 95,2.79 v94.74,3.05 | J201.G3 108.2,2.79 v108.46,3.05
N$22
  Top 0.61: T1.9 52.07,24.13 49.53,26.67 T1.3
N$23
  Top 0.406: IC202.5 104.9,24.13 104.14,23.37 100.58,23.37 99.55,22.34 R207.2 98.71,22.69 Q201.3
N$24
  Top 0.406: IC201.4 90.17,20.35 | 90.17,20.35 94.16,20.35 Q201.1 | R41.2 90.17,20.35
N$25
  Top 0.406: IC202.12 107.44,22.1 108.2,22.86 112.76,22.86 C201.1 113.54,22.11 113.54,22.1 121.16,14.48 R201.2
N$26
  Top 0.406: R206.2 TP13.TP | IC202.13 108.71,17.27 TP13.TP | IC202.14 109.98,17.53 TP13.TP
N$27  (via drill 0.6)
  Top 0.61: T1.2 50.29,29.21 v50.8,29.72 52.83,31.75 T1.12
  Bottom 0.61: R31.1 v50.8,29.72
N$28
  Top 1.27: D1.A R302.1 R303.1
N$29
  Top 1.27: T2.2 45.21,129.54 47.75,132.08 T2.12
N$30
  Top 1.27: T2.1 39.65,140.54 C117.1
N$31
  Top 1.27: J102.C 50.8,145.03 46.74,140.97 C117.2
N$32
  Top 0.406: R27.1 LED2.K
N$33
  Top 0.406: R28.1 LED1.K
N$34
  Top 0.61: J101.C C101.1
N$35
  Top 0.406: R4.1 74.68,63.74 C6.1 74.68,63.77 R12.2
N$36
  Top 0.406: R9.2 C4.1
N$37
  Top 0.406: R41.1 LED3.K
N$38
  Bottom 0.406: R10.2 C3.1
N$39
  Top 0.406: 63.5,49.53 R7.2 R1.2 62.61,45.08 C1.1
N$40
  Top 0.406: R17.1 26.92,50.56 C12.1 26.92,50.53 R25.2
N$41
  Top 0.61: T1.6 39.65,15 41.95,12.7 48.26,12.7 50.8,10.16 C101.2
N$42
  Top 0.406: C10.1 R22.2
N$43
  Top 0.61: IC301.IN 106.81,82.68 C13.1 R302.2
N$44
  Top 1.778: R301.1 J1.2 128.03,34.67 D301.C
N$45
  Top 1.27: 137.16,6.39 X1.1
  Top 1.778: J1.1 138.43,10.16 137.16,8.89 137.16,6.39
N$46
  Top 1.27: D1.C 140.97,85.09
  Top 2.54: R301.2 140.97,50.8 C301.+ 140.97,85.09 140.97,107.7 140.76,107.9 C23.1 140.97,108.16 140.97,117.86 133.86,124.97 L4.1
N$47
  Top 0.406: R40.1 104.9,134.62 106.43,133.1 106.43,125.12 L5.1
  Top 2.54: L5.1 113.54,124.97 | 113.54,124.97 L4.2 | C303.1 113.54,124.97
N$48
  Bottom 0.406: R23.2 C9.1
N$49
  Top 0.61: IC302.IN 106.81,68.71 C14.1 R303.2
N$50
  Top 0.406: R20.2 R14.2 38.99,69.22 C7.1
N$51
  Top 0.406: R29.2 95.5,99.82 96.77,101.09 100.84,101.09 101.6,100.33 J2.3
N$52
  Top 1.27: T2.3 46.23,127 48.77,129.54 T2.11
N$57
  Top 0.61: T1.8 51.31,21.59 48.77,24.13 T1.4
N$58
  Top 1.27: T2.4 47.24,124.46 49.78,127 T2.10
VB  (via drill 0.6)
  Top 0.406: R40.2 98.55,134.62 96.77,132.84 96.77,125.12 L5.2
  Top 1.27: L6.2 C20.1
  Top 2.54: L5.2 89.92,124.97 89.66,124.71
  other vias: 86.36,125.98 85.09,125.98 87.63,125.98 16.51,125.98 15.24,125.98 13.97,125.98 29.21,123.44 26.67,123.44 24.13,123.44 74.93,123.7 72.39,123.7 77.47,123.7
  pour Bottom (isolate 0.406): 12.7,128.27 88.9,128.27 88.9,120.65 12.7,120.65
  pour Top: 12.7,128.27 12.7,122.94 30.48,122.94 30.48,134.11 18.54,134.11
  pour Top: 69.85,123.19 90.17,123.19 90.17,127 83.06,134.11 69.85,134.11
VB_CT  (via drill 0.6)
  Top 1.27: T2.7 v52.07,119.38 v50.55,119.38 v48.77,119.38 48.01,119.38 45.47,121.92 T2.5
  Bottom 0.813: R30.2 v50.55,119.38
  Bottom 1.27: v52.07,119.38 v50.55,119.38 v48.77,119.38
VB_CT1
  Top 0.61: T1.7 50.8,19.05 48.26,21.59 T1.5

### Text on the board
Top: DIY RFPA MODULE | Rev A | Mike Twieg 2022036